# EasyEDA Pro project ESP32-S功能模块V2.epro

# Schematic ESP32-S功能模块V2_5V_GND互换
Board Name: ESP32-S功能模块V2_5V_GND互换; Create Date: 2025-08-16; Page Name: P1; Project Name: ESP32-S3功能模块; Schematic Name: ESP32-S功能模块V2_5V_GND互换; Update Date: 2025-08-16; Company: 嘉立创EDA; Page Size: A4; Version: V1.0
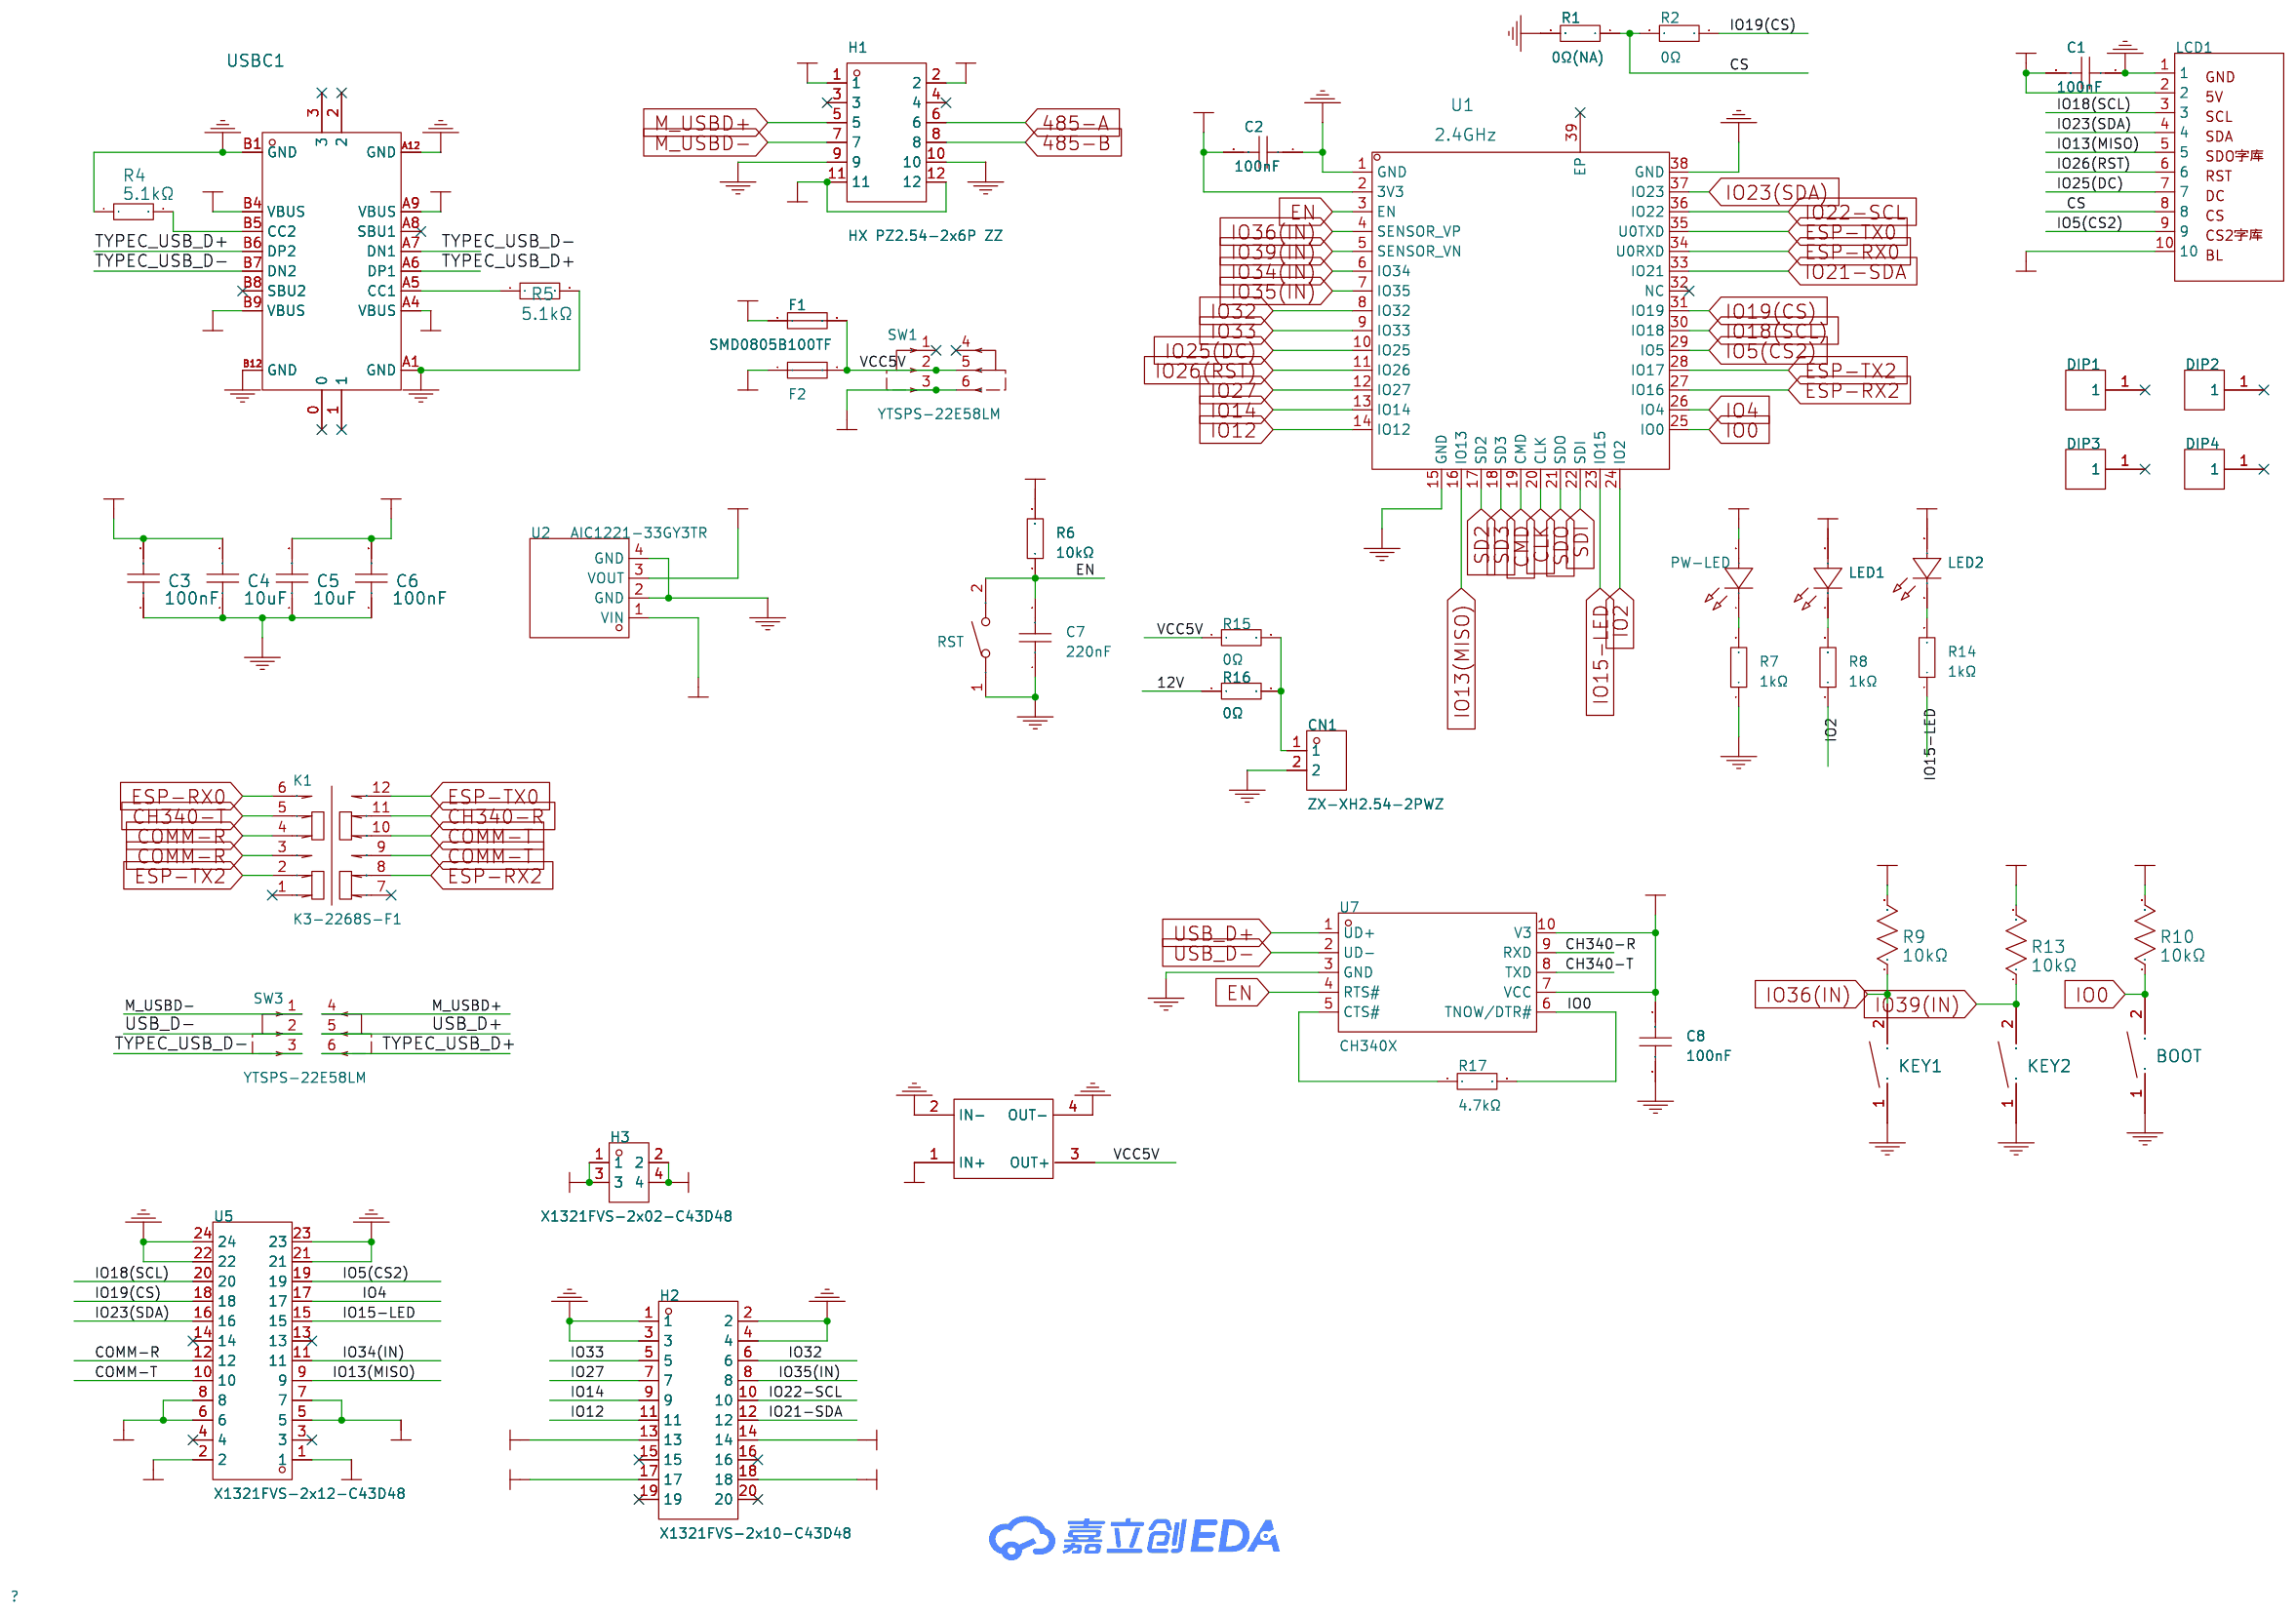
[diagram p0: schematic sheet]

## Parts
BOOT  TS-1088-AR02016  [SW-SMD_L3.9-W3.0-P4.45]
C1  100nF  [C0603]
C2  100nF  [C0603]
C3  100nF  [C0603]
C4  10uF  [C0805]
C5  10uF  [C0805]
C6  100nF  [C0603]
C7  220nF  [C0603]
C8  100nF  [C0603]
CN1  ZX-XH2.54-2PWZ  [CONN-TH_2P-P2.50_ZX-XH2.54-2PWZ]
DIP1  -  [贴片铜柱M3*6+1]
DIP2  -  [贴片铜柱M3*6+1]
DIP3  -  [贴片铜柱M3*6+1]
DIP4  -  [贴片铜柱M3*6+1]
F1  SMD0805B100TF  [F0805]
F2  SMD0805B100TF  [F0805]
H1  HX PZ2.54-2x6P ZZ  [HDR-TH_12P-P2.54-V-M-R2-C6-S2.54_77313-101-12LF]
H2  X1321FVS-2x10-C43D48  [HDR-SMD_20P-P1.27-V-F-R2-C10-LS4.8]
H3  X1321FVS-2x02-C43D48  [HDR-SMD_4P-P1.27-V-F-R2-C2-LS4.8]
K1  5.1kΩ  [SW-TH_K3-2268S-F1]
KEY1  TS665WS  [SW-SMD_L6.0-W6.0-LS6.6]
KEY2  TS665WS  [SW-SMD_L6.0-W6.0-LS6.6]
LCD1  -  [1.54寸带字库液晶屏]
LED1  XL-1608UBC-04  [LED0603-RD_BLUE]
LED2  XL-1608UBC-04  [LED0603-RD_BLUE]
PW-LED  XL-1608UBC-04  [LED0603-RD_BLUE]
R1  0Ω(NA)  [R0603]
R2  0Ω  [R0603]
R4  5.1kΩ  [R0603]
R5  5.1kΩ  [R0603]
R6  10kΩ  [R0603]
R7  1kΩ  [R0603]
R8  1kΩ  [R0603]
R9  10kΩ  [R0603]
R10  10kΩ  [R0603]
R13  10kΩ  [R0603]
R14  1kΩ  [R0603]
R15  0Ω  [R0603]
R16  0Ω  [R0603]
R17  4.7kΩ  [R0603]
RST  TS-1088-AR02016  [SW-SMD_L3.9-W3.0-P4.45]
SW1  YTSPS-22E58LM  [SW-SMD_6P-L5.8-W5.8-P2.00-LS8.0_YTSPS-22E58LM]
SW3  YTSPS-22E58LM  [SW-SMD_6P-L5.8-W5.8-P2.00-LS8.0_YTSPS-22E58LM]
U1  2.4GHz  [WIRELM-SMD_ESP32-S]
U2  AIC1221-33GY3TR  [SOT-223_L6.5-W3.5-P2.30-LS7.0-BR]
U5  X1321FVS-2x12-C43D48  [HDR-SMD_24P-P1.27-V-F-R2-C12-LS4.8]
U6  -  [DC-DCmini]
U7  CH340X  [MSOP-10_L3.0-W3.0-P0.50-LS5.0-BL]
USBC1  TYPE-C-31-M-12  [USB-C_SMD-TYPE-C-31-M-12]

## Library data of the parts
BOOT = TS-1088-AR02016: 电路结构:单刀单掷;按钮形状:圆形按钮;作用力:160gf;安装方式:立贴;开关长度:4mm;开关宽度:3mm;开关高度:2mm;带支架:不带;触点电流:50mA;额定电压(DC):12V;绝缘电阻:100MΩ;机械寿命:10万次;; LCSC Part Name: 4*3*2mm 立贴 轻触开关; Supplier Part: C720477; Manufacturer: XUNPU(讯普); Supplier Footprint: SMD; JLCPCB Part Class: Extended Part; Datasheet: https://atta.szlcsc.com/upload/public/pdf/source/20200810/C720475_60D09DD6C54279ADDB2DC25100F1CC11.pdf; Supplier: LCSC; Circuit: 单刀单掷; Actuator Style: 圆形按钮; Operating Force: 160gf; Mounting Style: 立贴; Switch Length: 4mm; Switch Width: 3mm; Switch Height: 2mm; Strike Gundam: 不带; Contact Current: 50mA; Voltage Rating (DC): 12V; Insulation Resistance: 100MΩ; Actuator/Cap Color: 黑色; Pin Style: SMD接片; Mechanical Life: 10万次; Operating Temperature: -30℃~+80℃
C1-C3 C6-C8 = CC0603KRX7R9BB104: 容值:100nF;精度:±10%;额定电压:50V;材质(温度系数):X7R;; LCSC Part Name: 100nF ±10% 50V; Supplier Part: C14663; Manufacturer: YAGEO(国巨); Supplier Footprint: 0603; JLCPCB Part Class: 基础库; Datasheet: https://atta.szlcsc.com/upload/public/pdf/source/20180910/C282072_33301C7F631E79921B82A8DAC6BCC5B3.pdf; Supplier: LCSC; Tolerance: ±10%; Voltage Rated: 50V; Temperature Coefficient: X7R
C4 C5 = CL21A106KAYNNNE_C15850: 容值:10uF;精度:±10%;额定电压:25V;材质(温度系数):X5R;; LCSC Part Name: 10uF ±10% 25V; Supplier Part: C15850; Manufacturer: SAMSUNG(三星); Manufacturer Part: CL21A106KAYNNNE; Supplier Footprint: 0805; JLCPCB Part Class: Basic Part; Datasheet: https://atta.szlcsc.com/upload/public/pdf/source/20160103/1457707679302.pdf; Supplier: LCSC; Tolerance: ±10%; Voltage Rated: 25V; Temperature Coefficient: X5R
CN1 = ZX-XH2.54-2PWZ: 插针结构:1x2P;间距:2.5mm;安装方式:弯插;参考系列:XH;总PIN数:2P;排数:1;每排PIN数:2;行距:-;额定电流:3A;触头材质:黄铜;触头镀层:锡;工作温度范围:-25℃~+85℃;; LCSC Part Name: 1x2P 间距:2.5mm 弯插 系列:XH; Supplier Part: C7429641; Manufacturer: Megastar(兆星); Supplier Footprint: 弯插,P=2.5mm; JLCPCB Part Class: 扩展库; Datasheet: https://atta.szlcsc.com/upload/public/pdf/source/20230619/56AE8F2E01CDFEAA97FC89B5ED558AB5.pdf; Supplier: LCSC; Pins Structure: 1x2P; Pitch: 2.5mm; Mounting Type: 弯插; Reference Series: XH; Number of Pins: 2P; Number of Rows: 1; Number of PINs Per Row: 2; Rated Current: 3A; Contact Material: 黄铜; Contact Plating: 锡; Operating Temperature: -25℃~+85℃; Rated Voltage (Max): 250V; Plastic Material: PA66; Flame Retardant Rating: UL94V-0; Color: 白色; Z-Height of the Board: 5.9mm; X-Length of Bottom Edge on Board (Spacing Line): 7.5mm; Y-Width of Bottom Edge on Board: 7.32mm
DIP1-DIP4 = 贴片铜柱M3*6+1
F1 F2 = SMD0805B050TF: 最大电压:6V;最大电流:100A;保持电流:500mA;跳闸电流:1A;最大动作时间:100ms;; LCSC Part Name: 6V 0.5A; Supplier Part: C269104; Manufacturer: Brightking(台湾君耀); Supplier Footprint: 0805; JLCPCB Part Class: Extended Part; Datasheet: https://atta.szlcsc.com/upload/public/pdf/source/20180814/C269104_466839A5DB65F6E723CA6A162ACE747B.pdf; Supplier: LCSC; Operating Voltage (Max): 6V; Current Rating (Max): 100A; Hold Current: 500mA; Trip Current: 1A; Maximum Time to Trip: 100ms
H1 = HX PZ2.54-2x6P ZZ: 插针结构:2x6P;间距:2.54mm;行距:2.54mm;圆针/方针:方针;安装类型:直插;排数:双排;总PIN位数:12P;额定电流:3A;额定电压:-;配合针长度:6mm;塑高:2.5mm;端接针长度:3mm;触头材质:黄铜;触头镀层:金;工作温度范围:-40℃~+105℃;颜色:黑色;; LCSC Part Name: 2x6P 间距:2.54mm 方针 直插; Supplier Part: C32713279; Manufacturer: hanxia(韩下); Supplier Footprint: 插件,P=2.54mm; JLCPCB Part Class: Extended Part; Datasheet: https://atta.szlcsc.com/upload/public/pdf/source/20240723/7CFD6BBE81D942E4FB6053E60626E655.pdf; Supplier: LCSC; Pin Structure: 2x6P; Pitch: 2.54mm; Row Spacing: 2.54mm; Circluar Pins/Square Pins: 方针; Mounting Type: 直插; Number of Rows: 双排; Number of Pins: 12P; Current Rating (Max): 3A; Length of Mating Pin: 6mm; Insulation Height: 2.5mm; Length of End Connection Pin: 3mm; Contact Material: 黄铜; Contact Plating: 金; Operating Temperature Range: -40℃~+105℃; Color: 黑色
H2 = X1321FVS-2x10-C43D48: 插孔结构:2x10P;间距:1.27mm;行距:-;圆孔/方孔:方孔;安装类型:立贴;排数:双排;总孔位数:20P;额定电流:1A;额定电压:250V;插孔方向:顶部;塑高:4.3mm;触头材质:黄铜;触头镀层:金;工作温度范围:-40℃~+105℃;焊接温度(最大值):260℃;; LCSC Part Name: 间距:1.27mm 2x10P 立贴; Supplier Part: C2684738; Manufacturer: XKB Connectivity(中国星坤); Supplier Footprint: SMD,P=1.27mm; JLCPCB Part Class: 扩展库; Datasheet: https://atta.szlcsc.com/upload/public/pdf/source/20211011/FC3020149D6BF5F353A6158A05565A46.pdf; Supplier: LCSC; Holes Structure: 2x10P; Pitch: 1.27mm; Circular Hole / Square Hole: 方孔; Mounting Type: 立贴; Number of Rows: 双排; Number of Holes: 20P; Current Rating (Max): 1A; Voltage Rating (Max): 250V; Holes Direction: 顶部; Insulation Height: 4.3mm; Contact Material: 黄铜; Contact Plating: 金; Operating Temperature Range: -40℃~+105℃; Soldering Temperature(Max): 260℃
H3 = X1321FVS-2x02-C43D48: 插孔结构:2x2P;间距:1.27mm;行距:-;圆孔/方孔:方孔;安装类型:立贴;排数:双排;总孔位数:4P;额定电流:1A;额定电压:250V;插孔方向:顶部;塑高:4.3mm;触头材质:黄铜;触头镀层:金;工作温度范围:-40℃~+105℃;焊接温度(最大值):260℃;; LCSC Part Name: 间距:1.27mm 2x2P 立贴; Supplier Part: C2684730; Manufacturer: XKB Connectivity(中国星坤); Supplier Footprint: SMD,P=1.27mm; JLCPCB Part Class: 扩展库; Datasheet: https://atta.szlcsc.com/upload/public/pdf/source/20211011/FC3020149D6BF5F353A6158A05565A46.pdf; Supplier: LCSC; Holes Structure: 2x2P; Pitch: 1.27mm; Circular Hole / Square Hole: 方孔; Mounting Type: 立贴; Number of Rows: 双排; Number of Holes: 4P; Current Rating (Max): 1A; Voltage Rating (Max): 250V; Holes Direction: 顶部; Insulation Height: 4.3mm; Contact Material: 黄铜; Contact Plating: 金; Operating Temperature Range: -40℃~+105℃; Soldering Temperature(Max): 260℃
K1 = K3-2268S-F1: 额定电流(DC):300mA;额定电压(DC):6V;额定电流(AC):-;额定电压(AC):-;电路结构:四刀双掷;安装方式:卧贴;机械寿命:1万次;开关颜色:黑色;; LCSC Part Name: 卧贴双档 滑动开关; Supplier Part: C223866; Manufacturer: 韩国韩荣; Supplier Footprint: SMD; JLCPCB Part Class: Extended Part; Datasheet: https://atta.szlcsc.com/upload/public/pdf/source/20210810/F3B8165E5EF761676C00BB7ABA008864.pdf; Supplier: LCSC; Current Rating (DC): 300mA; Voltage Rating (DC): 6V; Circuit: 四刀双掷; Mounting Style: 卧贴; Mechanical Life: 1万次; Actuator Color: 黑色; Actuator Style: 矩形柱状; Pin Style: 鸥翼型; Operating Temperature: -25℃~+80℃; Switch Length: 14.9mm; Switch Width: 3.5mm; Switch Height: 3.5mm; Tolerance: ±1%; Power(Watts): 100mW; Overload Voltage (Max): 75V; Temperature Coefficient: ±100ppm/℃; Type: 厚膜电阻; Operating Temperature Range: -55℃~+155℃
KEY1 KEY2 = TS665WS_C398058: 触点电流:50mA;额定电压(DC):12V;电路结构:单刀单掷;安装方式:立贴;带灯:-;作用力:200gf@±50gf;机械寿命:-;; LCSC Part Name: 6*6*5mm 立贴 轻触开关 无声软胶; Supplier Part: C398058; Manufacturer: SHOU HAN(首韩); Supplier Footprint: SMD; JLCPCB Part Class: Extended Part; Datasheet: https://atta.szlcsc.com/upload/public/pdf/source/20190620/C398058_75EC11C2CCBC6DD113AE79D58CB25A40.pdf; Supplier: LCSC; Contact Current: 50mA; Voltage Rating (DC): 12V; Circuit: 单刀单掷; Mounting Style: 立贴; Actuator Style: 圆形按钮; Operating Force: 200gf@±50gf; Switch Length: 6mm; Switch Width: 6mm; Switch Height: 5mm; Insulation Resistance: 100MΩ; Actuator/Cap Color: 黑色; Operating Temperature: -25℃~+70℃; Pin Style: SMD接片; Strike Gundam: 否
LCD1 = 1.54寸带字库液晶屏
LED1 LED2 PW-LED = XL-1608UBC-04: 灯头类型:-;发光颜色:蓝色;正向压降(Vf):3.3V;功率:70mW;正向电流:20mA;波长:455nm~475nm;二极管配置:-;透镜颜色:无色透明透镜;色温:-;发光强度:300mcd;发光角度:120°;载带方式:正贴;工作温度:-20℃~+85℃;; Supplier Part: C965807; Manufacturer: XINGLIGHT(成兴光); Supplier Footprint: 0603; JLCPCB Part Class: 扩展库; Datasheet: https://atta.szlcsc.com/upload/public/pdf/source/20250213/9D28F40E58C3285D8CA3C7212E2FBA3B.pdf; Supplier: LCSC; Illumination Color: 蓝色; Voltage - Forward(Vf): 3.3V; Power(Watts): 70mW; Forward Current: 20mA; Wavelength - Dominant: 455nm~475nm; Peak Wavelength: 470nm; Lens Color: 无色透明透镜; Luminous Intensity: 300mcd; Viewing Angle: 120°; Mounting Sytle: 正贴; Operating Temperature: -20℃~+85℃
R1 R2 R15 R16 = 0603WAF0000T5E: 电阻类型:厚膜电阻;阻值:0Ω;精度:±1%;功率:100mW;最大工作电压:75V;; LCSC Part Name: 0Ω ±1% 100mW 厚膜电阻; Supplier Part: C21189; Manufacturer: UNI-ROYAL(厚声); Supplier Footprint: 0603; JLCPCB Part Class: 基础库; Datasheet: https://atta.szlcsc.com/upload/public/pdf/source/20200306/C422600_1E6D84923E4A46A82E41ADD87F860B5C.pdf; Supplier: LCSC; Type: 厚膜电阻; Tolerance: ±1%; Power(Watts): 100mW; Overload Voltage (Max): 75V; Operating Temperature Range: -55℃~+155℃
R4 R5 = 0603WAF5101T5E: 阻值:5.1kΩ;精度:±1%;功率:100mW;温度系数:±100ppm/℃;电阻类型:厚膜电阻;; LCSC Part Name: 5.1kΩ ±1% 100mW 厚膜电阻; Supplier Part: C23186; Manufacturer: UNI-ROYAL(厚声); Supplier Footprint: 0603; JLCPCB Part Class: Basic Part; Datasheet: https://atta.szlcsc.com/upload/public/pdf/source/20200306/C422600_1E6D84923E4A46A82E41ADD87F860B5C.pdf; Supplier: LCSC; Tolerance: ±1%; Power(Watts): 100mW; Overload Voltage (Max): 75V; Temperature Coefficient: ±100ppm/℃; Type: 厚膜电阻; Operating Temperature Range: -55℃~+155℃
R6 R9 R10 R13 = 0603WAF1002T5E: 电阻类型:厚膜电阻;阻值:10kΩ;精度:±1%;功率:100mW;最大工作电压:75V;温度系数:±100ppm/℃;; LCSC Part Name: 厚膜电阻 10kΩ ±1% 100mW; Supplier Part: C25804; Manufacturer: UNI-ROYAL(厚声); Supplier Footprint: 0603; JLCPCB Part Class: 基础库; Datasheet: https://atta.szlcsc.com/upload/public/pdf/source/20200306/C422600_1E6D84923E4A46A82E41ADD87F860B5C.pdf; Supplier: LCSC; Type: 厚膜电阻; Tolerance: ±1%; Power(Watts): 100mW; Overload Voltage (Max): 75V; Temperature Coefficient: ±100ppm/℃; Operating Temperature Range: -55℃~+155℃
R7 R8 R14 = 0603WAF1001T5E: 电阻类型:厚膜电阻;阻值:1kΩ;精度:±1%;功率:100mW;最大工作电压:75V;温度系数:±100ppm/℃;; LCSC Part Name: 1kΩ ±1% 100mW 厚膜电阻; Supplier Part: C21190; Manufacturer: UNI-ROYAL(厚声); Supplier Footprint: 0603; JLCPCB Part Class: 基础库; Datasheet: https://atta.szlcsc.com/upload/public/pdf/source/20200306/C422600_1E6D84923E4A46A82E41ADD87F860B5C.pdf; Supplier: LCSC; Type: 厚膜电阻; Tolerance: ±1%; Power(Watts): 100mW; Overload Voltage (Max): 75V; Temperature Coefficient: ±100ppm/℃; Operating Temperature Range: -55℃~+155℃
R17 = 0603WAF4701T5E: 电阻类型:厚膜电阻;阻值:4.7kΩ;精度:±1%;功率:100mW;最大工作电压:75V;温度系数:±100ppm/℃;; LCSC Part Name: 4.7kΩ ±1% 100mW 厚膜电阻; Supplier Part: C23162; Manufacturer: UNI-ROYAL(厚声); Supplier Footprint: 0603; JLCPCB Part Class: 基础库; Datasheet: https://atta.szlcsc.com/upload/public/pdf/source/20200306/C422600_1E6D84923E4A46A82E41ADD87F860B5C.pdf; Supplier: LCSC; Type: 厚膜电阻; Tolerance: ±1%; Power(Watts): 100mW; Overload Voltage (Max): 75V; Temperature Coefficient: ±100ppm/℃; Operating Temperature Range: -55℃~+155℃
RST = TS-1088-AR02016: 电路结构:单刀单掷;按钮形状:圆形按钮;作用力:160gf;安装方式:立贴;开关长度:4mm;开关宽度:3mm;开关高度:2mm;带支架:不带;触点电流:50mA;额定电压(DC):12V;绝缘电阻:100MΩ;机械寿命:10万次;; LCSC Part Name: 4*3*2mm 立贴 轻触开关; Supplier Part: C720477; Manufacturer: XUNPU(讯普); Supplier Footprint: SMD; JLCPCB Part Class: 扩展库; Datasheet: https://atta.szlcsc.com/upload/public/pdf/source/20200810/C720475_60D09DD6C54279ADDB2DC25100F1CC11.pdf; Supplier: LCSC; Circuit: 单刀单掷; Actuator Style: 圆形按钮; Operating Force: 160gf; Mounting Style: 立贴; Switch Length: 4mm; Switch Width: 3mm; Switch Height: 2mm; Strike Gundam: 不带; Contact Current: 50mA; Voltage Rating (DC): 12V; Insulation Resistance: 100MΩ; Actuator/Cap Color: 黑色; Pin Style: SMD接片; Mechanical Life: 10万次; Operating Temperature: -30℃~+80℃
SW1 SW3 = YTSPS-22E58LM: 电路结构:双刀双掷;自锁/无锁:自锁;安装方式:立贴;触点电流:500mA;额定电压 (DC):50V;作用力:1.8N;机械寿命:2万次;; LCSC Part Name: 5.8x5.8mm 贴片按键开关; Supplier Part: C2941005; Manufacturer: YIYUAN(怡远); Supplier Footprint: SMD; JLCPCB Part Class: 扩展库; Datasheet: https://atta.szlcsc.com/upload/public/pdf/source/20220105/5C885D3D6FAB3BC8492E6C715FEB9C6C.pdf; Supplier: LCSC; Circuit: 双刀双掷; Self Lock / No Lock: 自锁; Actuator Style: 方形柱塞; Mounting Style: 立贴; Contact Current: 500mA; Voltage Rating (DC): 50V; Insulation Resistance: 1000MΩ; Actuator/Cap Color: 白色; Pin Style: PC引脚; Operating Force: 1.8N; Operating Temperature: -40℃~+85℃; Mechanical Life: 2万次
U1 = ESP32-S: 频率:2.4GHz;发射功率:17dBm;核心处理器:LX6;天线形式:板载 PCB 天线/外接 IPEX;接收灵敏度:-90dBm;; Supplier Part: C277944; Manufacturer: Ai-Thinker(安信可); Supplier Footprint: SMD; JLCPCB Part Class: Extended Part; Datasheet: https://atta.szlcsc.com/upload/public/pdf/source/20211217/F4BEA33E732D6002D10DAED85BBCB52B.pdf; Supplier: LCSC; Output Power: 17dBm; Core Processor: LX6; Support Interface: I2C；UART；DAC；SPI；PWM；ADC; Antenna Type: 板载 PCB 天线/外接 IPEX; Wireless Standard: 802.11b/g/n; Operating Voltage: 3.3V; Sensitivity: -90dBm; Operating Temperature: -40℃~+85℃
U2 = AIC1221-33GY3TR: 输出类型:固定;输出极性:正;最大输入电压:6V;输出电压:3.3V;输出电流:2A;电源纹波抑制比(PSRR):70dB@(1kHz);; Supplier Part: C211622; Manufacturer: AIC(沛亨半导体); Supplier Footprint: SOT-223; JLCPCB Part Class: 扩展库; Datasheet: https://atta.szlcsc.com/upload/public/pdf/source/20180412/C211622_EA532406C6A2C276C2B2012B0B841276.pdf; Supplier: LCSC; Output Type: 固定; Output Polarity: 正; Number of Outputs: 1; Maximum Input Voltage: 6V; Output Voltage: 3.3V; Dropout Voltage: 700mV@(2A); Output Current: 2A; Power Supply Rejection Ratio (PSRR): 70dB@(1kHz)
U5 = X1321FVS-2x12-C43D48: 插孔结构:2x12P;间距:1.27mm;行距:-;圆孔/方孔:方孔;安装类型:立贴;排数:双排;总孔位数:24P;额定电流:1A;额定电压:250V;插孔方向:顶部;塑高:4.3mm;触头材质:黄铜;触头镀层:金;工作温度范围:-40℃~+105℃;焊接温度(最大值):260℃;; LCSC Part Name: 间距:1.27mm 2x12P 立贴; Supplier Part: C2881860; Manufacturer: XKB Connectivity(中国星坤); Supplier Footprint: SMD,P=1.27mm; JLCPCB Part Class: 扩展库; Datasheet: https://atta.szlcsc.com/upload/public/pdf/source/20211011/FC3020149D6BF5F353A6158A05565A46.pdf; Supplier: LCSC; Holes Structure: 2x12P; Pitch: 1.27mm; Circular Hole / Square Hole: 方孔; Mounting Type: 立贴; Number of Rows: 双排; Number of Holes: 24P; Current Rating (Max): 1A; Voltage Rating (Max): 250V; Holes Direction: 顶部; Insulation Height: 4.3mm; Contact Material: 黄铜; Contact Plating: 金; Operating Temperature Range: -40℃~+105℃; Soldering Temperature(Max): 260℃
U6 = DC-DC模块mini
U7 = CH340X: Supplier Part: C3035748; Manufacturer: WCH(南京沁恒); Supplier Footprint: MSOP-10; JLCPCB Part Class: 扩展库; Datasheet: https://atta.szlcsc.com/upload/public/pdf/source/20230530/6E401E9554E9F5311886CC8B3F89B62E.pdf; Supplier: LCSC
USBC1 = TYPE-C-31-M-12: 连接器类型:Type-C;标准:-;公母:母;安装方式:-;触点数量:16P;端口数量:1;额定电流 - 电源:5A;工作温度范围:-;; LCSC Part Name: Type-C 母; Supplier Part: C165948; Manufacturer: 韩国韩荣; Supplier Footprint: SMD; JLCPCB Part Class: 扩展库; Datasheet: https://atta.szlcsc.com/upload/public/pdf/source/20220525/466408E853115E789EDB0DDC29077C05.pdf; Supplier: LCSC; Connector Type: Type-C; Gender: 母; Number of Contacts: 16P; Number of Ports: 1; Current Rating - Power (Max): 5A

## Nets
3.3V: C2.2 C5.2 C6.2 C8.1 H2.13 H2.14 LCD1.10 LED1.2(A) LED2.2(A) PW-LED.2(A) R6.2 R9.2 R10.2 R13.2 U1.2(3V3) U2.3(VOUT) U5.5 U5.6 U5.7 U5.8 U7.7(VCC) U7.10(V3)
5V: C1.2 C3.2 C4.2 H2.17 H2.18 LCD1.2 SW1.3 SW1.6 U2.1(VIN) U5.1 U5.2
12V: H1.1 H1.2 H3.1 H3.2 H3.3 H3.4 R16.1 U6.1(IN+)
GND: BOOT.1 C1.1 C2.1 C3.1 C4.1 C5.1 C6.1 C7.1 C8.2 CN1.2 H1.9 H1.10 H2.1 H2.2 H2.3 H2.4 KEY1.1 KEY2.1 LCD1.1 R1.2 R4.1 R5.2 R7.1 RST.1 U1.1(GND) U1.15(GND) U1.38(GND) U2.2(GND) U2.4(GND) U5.21 U5.22 U5.23 U5.24 U6.2(IN-) U6.4(OUT-) U7.3(GND) USBC1.A1(GND) USBC1.A12(GND) USBC1.B1(GND) USBC1.B12(GND)
VBUS: F1.1 USBC1.A4(VBUS) USBC1.A9(VBUS) USBC1.B4(VBUS) USBC1.B9(VBUS)
VCC5V: F1.2 F2.2 R15.1 SW1.2 SW1.5 U6.3(OUT+)
485-A: H1.6
485-B: H1.8
CH340-R: K1.11 U7.9(RXD)
CH340-T: K1.5 U7.8(TXD)
CLK: U1.20(CLK)
CMD: U1.19(CMD)
COMM-R: K1.3 K1.4 U5.12
COMM-T: K1.9 K1.10 U5.10
CS: LCD1.8 R1.1 R2.2
EN: C7.2 R6.1 RST.2 U1.3(EN) U7.4(RTS#)
ESP-RX0: K1.6 U1.34(U0RXD)
ESP-RX2: K1.8 U1.27(IO16)
ESP-TX0: K1.12 U1.35(U0TXD)
ESP-TX2: K1.2 U1.28(IO17)
IO0: BOOT.2 R10.1 R17.2 U1.25(IO0) U7.6(TNOW/DTR#)
IO2: R8.1 U1.24(IO2)
IO4: U1.26(IO4) U5.17
IO5(CS2): LCD1.9 U1.29(IO5) U5.19
IO12: H2.11 U1.14(IO12)
IO13(MISO): LCD1.5 U1.16(IO13) U5.9
IO14: H2.9 U1.13(IO14)
IO15-LED: R14.1 U1.23(IO15) U5.15
IO18(SCL): LCD1.3 U1.30(IO18) U5.20
IO19(CS): R2.1 U1.31(IO19) U5.18
IO21-SDA: H2.12 U1.33(IO21)
IO22-SCL: H2.10 U1.36(IO22)
IO23(SDA): LCD1.4 U1.37(IO23) U5.16
IO25(DC): LCD1.7 U1.10(IO25)
IO26(RST): LCD1.6 U1.11(IO26)
IO27: H2.7 U1.12(IO27)
IO32: H2.6 U1.8(IO32)
IO33: H2.5 U1.9(IO33)
IO34(IN): U1.6(IO34) U5.11
IO35(IN): H2.8 U1.7(IO35)
IO36(IN): KEY1.2 R9.1 U1.4(SENSOR_VP)
IO39(IN): KEY2.2 R13.1 U1.5(SENSOR_VN)
M_USBD+: H1.5 SW3.4
M_USBD-: H1.7 SW3.1
M_VCC: F2.1 H1.11 H1.12
SD2: U1.17(SD2)
SD3: U1.18(SD3)
SDI: U1.22(SDI)
SDO: U1.21(SDO)
TYPEC_USB_D+: SW3.6 USBC1.A6(DP1) USBC1.B6(DP2)
TYPEC_USB_D-: SW3.3 USBC1.A7(DN1) USBC1.B7(DN2)
USB_D+: SW3.5 U7.1(UD+)
USB_D-: SW3.2 U7.2(UD-)
$1N6077: R5.1 USBC1.A5(CC1)
$1N6100: R4.2 USBC1.B5(CC2)
$1N6280: PW-LED.1(K) R7.2
$1N6289: LED1.1(K) R8.2
$1N17912: LED2.1(K) R14.2
$1N31687: CN1.1 R15.2 R16.2
$1N33760: R17.1 U7.5(CTS#)

Not connected (* = marked no-connect by the designer): DIP1 1*; DIP2 1*; DIP3 1*; DIP4 1*; H1 3* 4*; H2 15* 16* 19* 20*; K1 1* 7*; SW1 1* 4*; U1 32(NC)* 39(EP)*; U5 3* 4* 13* 14*; USBC1 0* 1* 2* 3* A8(SBU1)* B8(SBU2)*

# Board ESP32-S功能模块V2_5V_GND互换
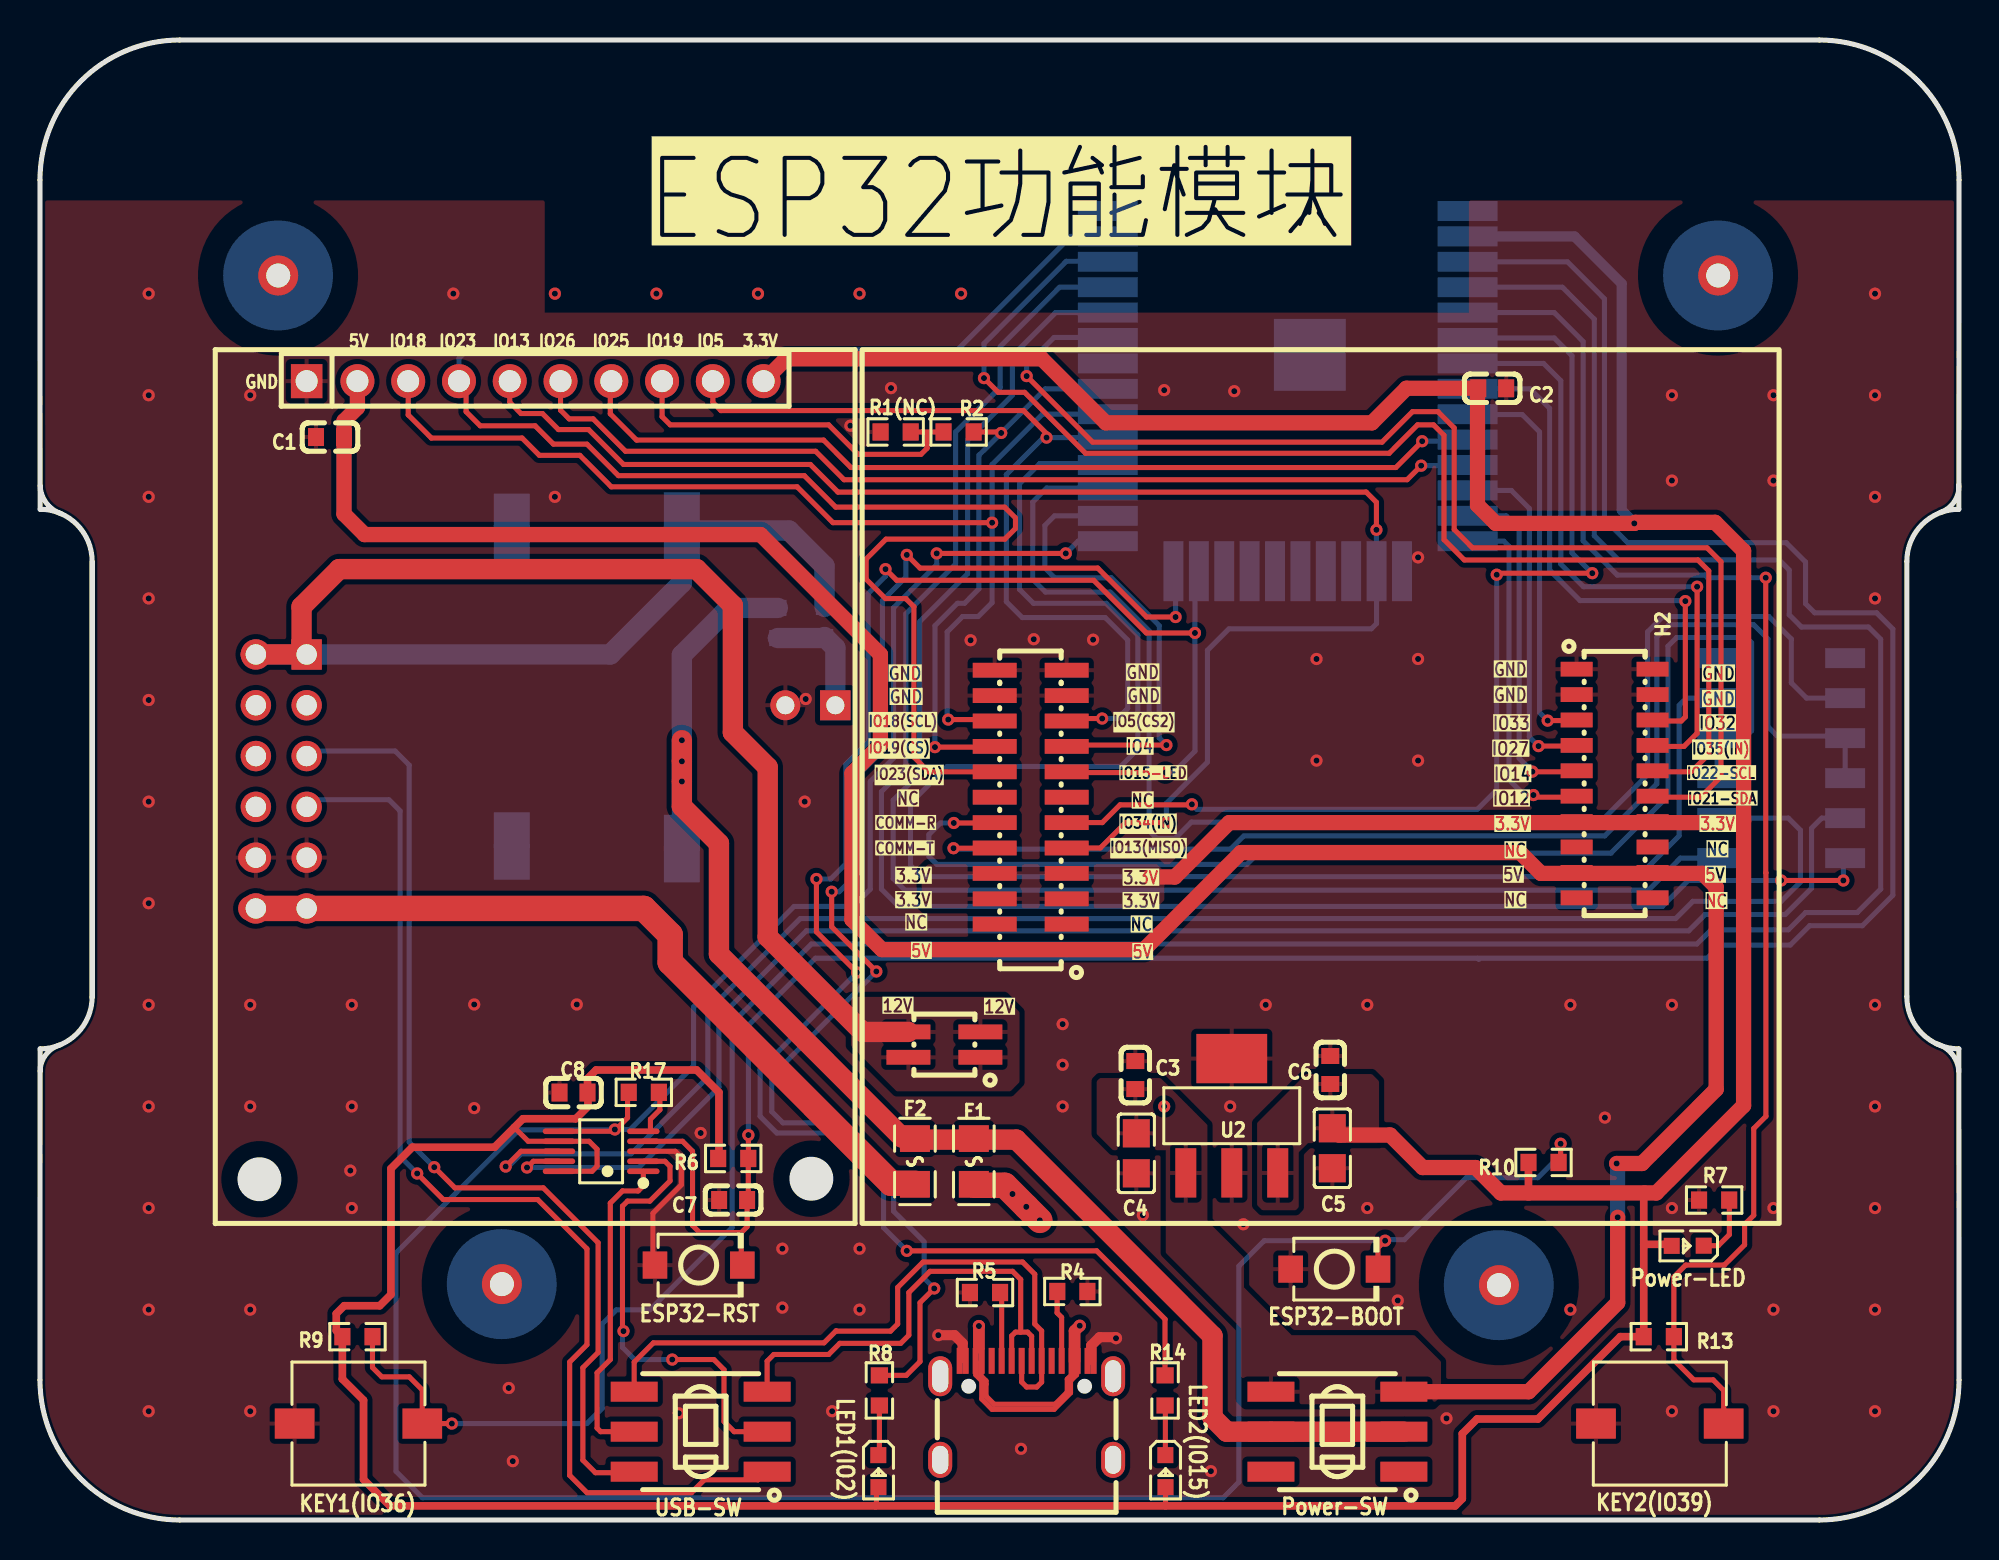
[diagram p1: board, top side]
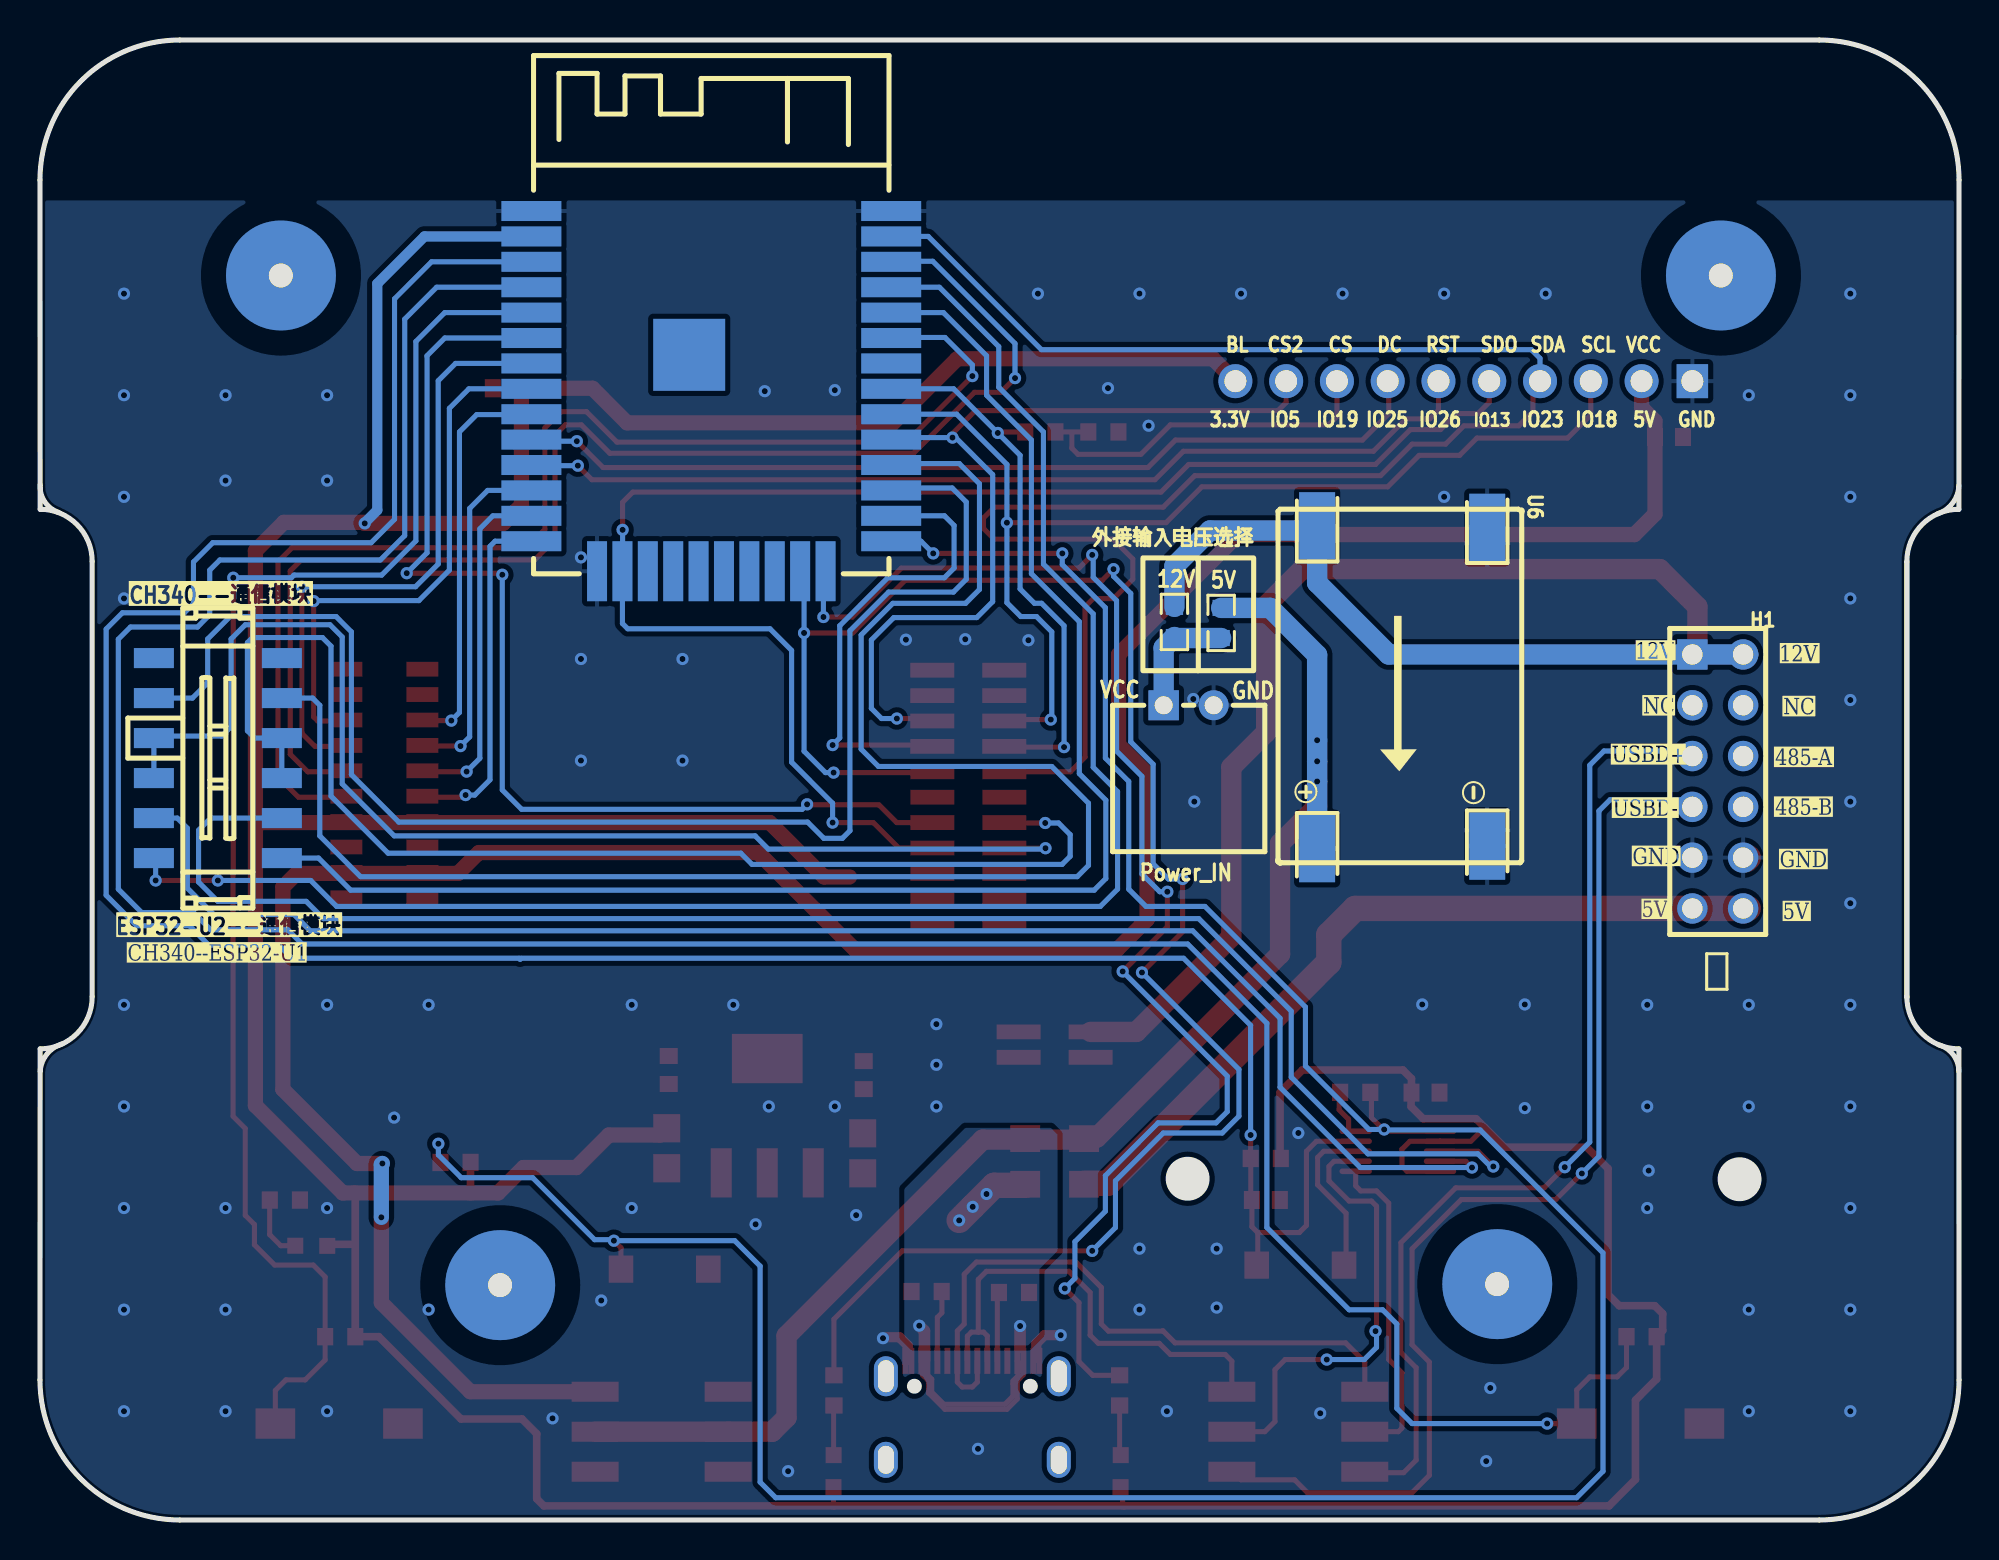
[diagram p2: board, bottom side, seen from below]

Outline 96 x 74 mm; copper layers: Top Layer, Bottom Layer. Coordinates in mm from the lower left corner of the outline.
Outline path: 0.01,22.44 arc(0.3,23.27) 1.03,23.76 ; 1.07,50.31 arc(0.32,50.85) 0.01,51.73 ; 2.61,47.89 2.61,26.11 ; 94.87,23.81 arc(95.65,23.3) 95.99,22.44 ; 95.99,51.76 arc(95.76,50.92) 95.07,50.38 ; 0,67 0.01,50.54 arc(1.85,49.77) 2.61,47.94 2.61,26.16 arc(1.85,24.32) 0.01,23.56 0,7 arc(2.05,2.05) 7,0 89,0 arc(93.95,2.05) 96,7 95.99,23.56 arc(94.15,24.32) 93.39,26.16 93.39,47.94 arc(94.15,49.77) 95.99,50.54 96,67 arc(93.95,71.95) 89,74 7,74 arc(2.05,71.95) 0,67
Stack: Top Layer 0.035mm / Dielectric1 1.51mm FR4 er 4.5 / Bottom Layer 0.035mm

## Design rules (mm)
template: JLCPCB Capability(Two Layers Board)
spacing copperThickness1oz (default): track to track 0.102, other pairs 0.152 to 0.3
spacing copperThickness2oz: track to track 0.203, other pairs 0.152 to 0.3
track width copperThickness1oz (default): min 0.127, default 0.254, max 2.54
track width copperThickness2oz: min 0.203, default 0.254, max 2.54
differential pair differentialPair (default): width min 0.127, default 0.254, max 2.54; gap min 0.152, default 0.152
via viaSize (default): diameter min 0.5, default 0.61, max 10; hole min 0.3, default 0.305, max 6.3

## Placement (name value [footprint] x y rotation side)
BOOT  TS-1088-AR02016  [SW-SMD_L3.9-W3.0-P4.45]  64.75 12.54 0 top
C1  100nF  [C0603]  14.51 54.15 0 top
C2  100nF  [C0603]  72.65 56.59 180 top
C3  100nF  [C0603]  54.79 22.25 270 top
C4  10uF  [C0805]  54.84 18.33 90 top
C5  10uF  [C0805]  64.65 18.59 90 top
C6  100nF  [C0603]  64.55 22.5 270 top
C7  220nF  [C0603]  34.67 16 0 top
C8  100nF  [C0603]  26.69 21.37 180 top
CN1  ZX-XH2.54-2PWZ  [CONN-TH_2P-P2.50_ZX-XH2.54-2PWZ]  38.54 40.74 180 bottom
DIP1  -  [贴片铜柱M3*6+1]  11.92 61.97 180 bottom
DIP2  -  [贴片铜柱M3*6+1]  83.95 61.97 180 bottom
DIP3  -  [贴片铜柱M3*6+1]  23.11 11.54 180 bottom
DIP4  -  [贴片铜柱M3*6+1]  72.98 11.49 180 bottom
F1  SMD0805B100TF  [F0805]  46.72 17.93 90 top
F2  SMD0805B100TF  [F0805]  43.77 17.93 90 top
H1  HX PZ2.54-2x6P ZZ  [HDR-TH_12P-P2.54-V-M-R2-C6-S2.54_77313-101-12LF]  12.07 36.93 270 bottom
H2  X1321FVS-2x10-C43D48  [HDR-SMD_20P-P1.27-V-F-R2-C10-LS4.8]  78.77 36.83 270 top
H3  X1321FVS-2x02-C43D48  [HDR-SMD_4P-P1.27-V-F-R2-C2-LS4.8]  45.24 23.77 90 top
K1  5.1kΩ  [SW-TH_K3-2268S-F1]  87.1 38.1 180 bottom
KEY1  TS665WS  [SW-SMD_L6.0-W6.0-LS6.6]  15.93 4.82 0 top
KEY2  TS665WS  [SW-SMD_L6.0-W6.0-LS6.6]  81.03 4.82 0 top
LCD1  -  [1.54寸带字库液晶屏]  24.77 45.56 0 top
LED1  XL-1608UBC-04  [LED0603-RD_BLUE]  41.94 2.44 270 top
LED2  XL-1608UBC-04  [LED0603-RD_BLUE]  56.3 2.44 270 top
PW-LED  XL-1608UBC-04  [LED0603-RD_BLUE]  82.43 13.71 180 top
R1(NC)  0Ω(NA)  [R0603]  42.8 54.4 180 top
R2  0Ω  [R0603]  45.95 54.4 180 top
R4  5.1kΩ  [R0603]  51.64 11.43 180 top
R5  5.1kΩ  [R0603]  47.27 11.37 180 top
R6  10kΩ  [R0603]  34.68 18.08 180 top
R7  1kΩ  [R0603]  83.75 16 0 top
R8  1kΩ  [R0603]  41.99 6.48 270 top
R9  10kΩ  [R0603]  15.88 9.17 180 top
R10  10kΩ  [R0603]  75.21 17.88 180 top
R13  10kΩ  [R0603]  80.98 9.17 180 top
R14  1kΩ  [R0603]  56.28 6.48 270 top
R15  0Ω  [R0603]  36.91 44.85 270 bottom
R16  0Ω  [R0603]  39.25 44.9 270 bottom
R17  4.7kΩ  [R0603]  30.21 21.38 180 top
RST  TS-1088-AR02016  [SW-SMD_L3.9-W3.0-P4.45]  32.95 12.75 0 top
SW1  YTSPS-22E58LM  [SW-SMD_6P-L5.8-W5.8-P2.00-LS8.0_YTSPS-22E58LM]  64.9 4.42 180 top
SW3  YTSPS-22E58LM  [SW-SMD_6P-L5.8-W5.8-P2.00-LS8.0_YTSPS-22E58LM]  33.05 4.42 180 top
U1  2.4GHz  [WIRELM-SMD_ESP32-S]  62.42 56.44 180 bottom
U2  AIC1221-33GY3TR  [SOT-223_L6.5-W3.5-P2.30-LS7.0-BR]  59.62 20.21 270 top
U5  X1321FVS-2x12-C43D48  [HDR-SMD_24P-P1.27-V-F-R2-C12-LS4.8]  49.56 35.5 90 top
U6  -  [DC-DCmini]  27.67 41.19 270 bottom
U7  CH340X  [MSOP-10_L3.0-W3.0-P0.50-LS5.0-BL]  28.07 18.44 90 top
USBC1  TYPE-C-31-M-12  [USB-C_SMD-TYPE-C-31-M-12]  49.36 5.48 0 top

## Footprints (pads in the part's own frame, mm; a bottom-side part is the same pattern mirrored in y, then rotated)
1.54寸带字库液晶屏
  rect 1.575x1.7 hole 1.1: 1(-11.43,11.379)
  round 1.7 hole 1.1: 2(-8.89,11.379) 3(-6.35,11.379) 4(-3.81,11.379) 5(-1.27,11.379) 6(1.27,11.379) 7(3.81,11.379) 8(6.35,11.379) 9(8.89,11.379) 10(11.43,11.379)
C0603
  rect 0.8x0.9 smd: 1(-0.7,0) 2(0.7,0)
C0805
  rect 1.41x1.35 smd: 1(-1,0) 2(1,0)
CONN-TH_2P-P2.50_ZX-XH2.54-2PWZ
  rect 1.524x1.5 hole 0.9: 1(-1.25,0)
  round 1.5 hole 0.9: 2(1.25,0)
DC-DCmini
  rect 1.8x1.8 smd: 1(-9.296,-4.445) 1(-7.721,-4.445) 2(-9.22,4.064) 2(-7.646,4.064) 3(6.832,-4.445) 3(8.408,-4.445) 4(6.705,4.064) 4(8.28,4.064)
F0805
  rect 1.335x1.5 smd: 1(-1.143,0) 2(1.143,0)
HDR-SMD_4P-P1.27-V-F-R2-C2-LS4.8
  rect 0.74x2.2 smd: 1(-0.635,-1.8) 2(-0.635,1.8) 3(0.635,-1.8) 4(0.635,1.8)
HDR-SMD_20P-P1.27-V-F-R2-C10-LS4.8
  rect 0.74x1.6 smd: 1(-5.715,-1.9) 2(-5.715,1.9) 3(-4.445,-1.9) 4(-4.445,1.9) 5(-3.175,-1.9) 6(-3.175,1.9) 7(-1.905,-1.9) 8(-1.905,1.9) 9(-0.635,-1.9) 10(-0.635,1.9) 11(0.635,-1.9) 12(0.635,1.9) 13(1.905,-1.9) 14(1.905,1.9) 15(3.175,-1.9) 16(3.175,1.9) 17(4.445,-1.9) 18(4.445,1.9) 19(5.715,-1.9) 20(5.715,1.9)
HDR-SMD_24P-P1.27-V-F-R2-C12-LS4.8
  rect 0.74x2.2 smd: 1(-6.985,-1.8) 2(-6.985,1.8) 3(-5.715,-1.8) 4(-5.715,1.8) 5(-4.445,-1.8) 6(-4.445,1.8) 7(-3.175,-1.8) 8(-3.175,1.8) 9(-1.905,-1.8) 10(-1.905,1.8) 11(-0.635,-1.8) 12(-0.635,1.8) 13(0.635,-1.8) 14(0.635,1.8) 15(1.905,-1.8) 16(1.905,1.8) 17(3.175,-1.8) 18(3.175,1.8) 19(4.445,-1.8) 20(4.445,1.8) 21(5.715,-1.8) 22(5.715,1.8) 23(6.985,-1.8) 24(6.985,1.8)
HDR-TH_12P-P2.54-V-M-R2-C6-S2.54_77313-101-12LF
  rect 1.52x1.52 hole 1.02: 1(-6.35,-1.27)
  round 1.52 hole 1.02: 2(-6.35,1.27) 3(-3.81,-1.27) 4(-3.81,1.27) 5(-1.27,-1.27) 6(-1.27,1.27) 7(1.27,-1.27) 8(1.27,1.27) 9(3.81,-1.27) 10(3.81,1.27) 11(6.35,-1.27) 12(6.35,1.27)
LED0603-RD_BLUE
  rect 0.8x0.8 smd: 1(-0.799,-0.004) 2(0.799,0.004)
MSOP-10_L3.0-W3.0-P0.50-LS5.0-BL
  oval 0.28x1.62 smd: 1(-1,-2.11) 2(-0.5,-2.11) 3(0,-2.11) 4(0.5,-2.11) 5(1,-2.11) 6(1,2.11) 7(0.5,2.11) 8(0,2.11) 9(-0.5,2.11) 10(-1,2.11)
R0603
  rect 0.806x0.864 smd: 1(-0.753,0) 2(0.753,0)
SOT-223_L6.5-W3.5-P2.30-LS7.0-BR
  rect 2.465x1.05 smd: 1(2.857,-2.3) 2(2.857,0) 3(2.857,2.3)
  rect 2.465x3.54 smd: 4(-2.857,0)
SW-SMD_6P-L5.8-W5.8-P2.00-LS8.0_YTSPS-22E58LM
  rect 2.35x1 smd: 1(-3.325,2) 2(-3.325,0) 3(-3.325,-2) 4(3.325,2) 5(3.325,0) 6(3.325,-2)
SW-SMD_L3.9-W3.0-P4.45
  rect 1.23x1.36 smd: 1(-2.185,0) 2(2.185,0)
SW-SMD_L6.0-W6.0-LS6.6
  rect 1.985x1.512 smd: 1(-3.192,0) 2(3.192,0)
SW-TH_K3-2268S-F1
  rect 2x1 smd: 1(3.2,5) 2(3.2,3) 3(3.2,1) 4(3.2,-1) 5(3.2,-3) 6(3.2,-5) 7(-3.2,5) 8(-3.2,3) 9(-3.2,1) 10(-3.2,-1) 11(-3.2,-3) 12(-3.2,-5)
USB-C_SMD-TYPE-C-31-M-12
  oval 1.2x2 hole 0.8x1.6: 0(-4.325,1.706) 1(4.325,1.706)
  oval 1.2x1.8 hole 0.8x1.4: 2(4.325,-2.474) 3(-4.325,-2.474)
  rect 0.3x1.3 smd: A1(-3.35,2.474) A4(-2.55,2.474) A5(-1.25,2.474) A6(-0.25,2.474) A7(0.25,2.474) A8(1.25,2.474) A9(2.55,2.474) A12(3.35,2.474) B1(3.05,2.474) B4(2.25,2.474) B5(1.75,2.474) B6(0.75,2.474) B7(-0.75,2.474) B8(-1.75,2.474) B9(-2.25,2.474) B12(-3.05,2.474)
WIRELM-SMD_ESP32-S
  rect 3x1 smd: 1(-9,9.005) 2(-9,7.735) 3(-9,6.465) 4(-9,5.195) 5(-9,3.925) 6(-9,2.655) 7(-9,1.385) 8(-9,0.115) 9(-9,-1.155) 10(-9,-2.425) 11(-9,-3.695) 12(-9,-4.965) 13(-9,-6.235) 14(-9,-7.505) 25(9,-7.505) 26(9,-6.235) 27(9,-4.965) 28(9,-3.695) 29(9,-2.425) 30(9,-1.155) 31(9,0.115) 32(9,1.385) 33(9,2.655) 34(9,3.925) 35(9,5.195) 36(9,6.465) 37(9,7.735) 38(9,9.005)
  rect 1x3 smd: 15(-5.715,-9.005) 16(-4.445,-9.005) 17(-3.175,-9.005) 18(-1.905,-9.005) 19(-0.635,-9.005) 20(0.635,-9.005) 21(1.905,-9.005) 22(3.175,-9.005) 23(4.445,-9.005) 24(5.715,-9.005)
  rect 3.6x3.6 smd: 39(-1.105,1.815)
贴片铜柱M3*6+1
  round 5.5 smd: 1(0.007,0.254)
  round 2 hole 1.2x1: 2(0,0.254)

## Nets
As in the schematic, except:
GND: BOOT.1 C1.1 C2.1 C3.1 C4.1 C5.1 C6.1 C7.1 C8.2 CN1.2 H1.9 H1.10 H2.1 H2.2 H2.3 H2.4 KEY1.1 KEY2.1 LCD1.1 R1(NC).2 R4.1 R5.2 R7.1 RST.1 U1.1 U1.15 U1.38 U2.2 U2.4 U5.21 U5.22 U5.23 U5.24 U6.2 U6.4 U7.3 USBC1.A1 USBC1.A12 USBC1.B1 USBC1.B12
CS: LCD1.8 R1(NC).1 R2.2

Pads without a net: DIP1 1 2; DIP2 1 2; DIP3 1 2; DIP4 1 2; H1 3 4; H2 15 16 19 20; K1 1 7; SW1 1 4; U1 32 39; U5 3 4 13 14; USBC1 0 1 2 3 A8 B8

## Via types
v1: diameter 0.61, hole 0.305, Top Layer to Bottom Layer, 154 vias

## Routing (per net, layer and track width the routed paths; a pad name or vN(x,y) marks a point on that pad's centre or on a via; arc(x,y) is an arc through that point)
3.3V: length 292.5
  Top Layer w0.254: U7.10 27.62,17.44 27.87,17.69 27.87,18.54 27.47,18.94 U7.7 24.42,18.94 23.73,19.63 ; 41.84,1.64 41.84,0.76 41.79,0.71 ; LED2.2 56.3,0.71 56.3,0.71
  Top Layer w0.381: 80.23,13.78 R13.2 79.05,9.17 74.94,5.05 71.89,5.05 71.15,4.31 71.15,1.06 70.8,0.71 17.51,0.71 16.19,2.03 16.19,5.99 15.13,7.05 R9.2 14.82,9.47 14.82,10.32 15.22,10.71 17,10.71 17.56,11.27 17.56,17.57 18.62,18.64 22.74,18.64 24.16,20.06 26.8,20.06 27.41,20.67 27.41,21.35 C8.1 27.39,22.07 27.82,22.5 32.85,22.5 33.97,21.38 33.97,18.12 R6.2 ; 80.23,13.78 80.23,16.31 80.27,16.35 ; 80.23,13.78 81.55,13.78 PW-LED.2 ; 74.46,16.35 R10.2
  Top Layer w0.762: 85.22,34.95 85.14,34.87 59.49,34.87 56.77,32.15 55.5,32.15 ; 85.22,34.95 85.22,48.46 83.8,49.88 79.81,49.88 v1(79.75,49.83) 72.83,49.83 71.91,50.74 71.91,56.59 ; 85.22,34.95 85.22,20.72 80.85,16.35 73.08,16.35 71.81,17.62 69.17,17.62 67.54,19.25 64.99,19.25 C5.2 ; 36.2,56.94 37.32,58.06 50.12,58.06 53.32,54.86 66.63,54.86 68.36,56.59 71.91,56.59 ; 71.91,56.59 C2.2
  Bottom Layer w0.508: U1.2 76.77,64.18 79.13,61.82 79.13,50.49 79.74,49.88
5V: length 133.2
  Top Layer w0.762: 15.88,56.94 15.88,55.62 15.21,54.95 C1.2 15.21,50.3 16.24,49.27 36.05,49.27 42.04,43.28 42.04,38.76 40.62,37.33 40.62,30.02 42.12,28.52 U5.2 U5.1 55.23,28.52 60.08,33.37 74.05,33.37 75.09,32.33 83.17,32.33 83.85,31.64 83.85,21.53 80.14,17.83 v1(78.87,17.83) ; SW1.3 74.47,6.42 78.92,10.87 v1(78.92,15.13)
  Bottom Layer w0.762: v1(78.92,15.13) 78.92,17.78 v1(78.87,17.83)
12V: length 89.6
  Top Layer w1.016: 10.55,43.28 13.09,43.28 13.09,45.66 14.97,47.54 32.85,47.54 34.66,45.73 34.66,39.38 36.4,37.64 36.4,29.15 41.15,24.41 H3.4
  Bottom Layer w1.016: R16.1 39.25,47.7 37.47,49.47 32.67,49.47 32.11,48.92 32.11,46.86 28.53,43.28 10.55,43.28
GND: length 12.5
  Top Layer w0.254: U7.3 31.78,18.44 32.09,18.13 32.09,16.76 30.66,15.34 30.66,12.85 RST.1
  Top Layer w0.508: v1(44.94,9.24) 45.75,9.24 46.16,8.83 46.16,8.11 ; v1(53.83,9.09) 53.78,9.14 53,9.14 52.59,8.72 52.59,8.01
  Top Layer w1.27: 10.55,33.12 10.65,33.02
  vias: v1(5.44,61.32) v1(5.44,56.24) v1(5.44,51.16) v1(5.44,46.08) v1(5.44,41) v1(5.44,35.92) v1(5.44,30.84) v1(5.44,25.76) v1(5.44,20.68) v1(5.44,15.6) v1(5.44,10.52) v1(5.44,5.44) v1(10.52,56.24) v1(10.52,25.76) v1(10.52,20.68) v1(10.52,10.52) v1(10.52,5.44) v1(15.52,17.47) v1(15.6,25.76) v1(15.6,20.68) v1(15.6,15.6) v1(20.68,61.32) v1(21.72,25.78) v1(21.72,20.59) v1(23.45,6.6) v1(23.65,2.94) v1(25.76,61.32) v1(25.76,51.16) v1(26.85,25.78) v1(30.84,61.32) v1(31.96,5.34) v1(33.05,19.35) v1(35.92,61.32) v1(37.14,13.57) v1(37.14,10.62) v1(38.31,41.05) v1(38.26,35.92) v1(39.63,5.44) v1(40.54,54.71) v1(41,61.32) v1(41,13.57) v1(41,10.52) v1(42.57,56.59) v1(46.08,61.32) v1(46.55,43.99) v1(49.08,3.56) v1(49.71,44.04) v1(51.16,24.79) v1(51.16,22.76) v1(51.16,20.68) v1(52.68,44.02) v1(55.17,15.24) v1(56.24,56.49) v1(56.24,20.68) v1(58.58,2.44) v1(59.54,20.68) v1(59.74,56.44) v1(60.2,14.79) v1(61.32,25.76) v1(63.86,43.05) v1(63.86,37.97) v1(66.4,25.76) v1(66.4,15.6) v1(67.92,10.98) v1(68.94,48.13) v1(68.94,43.05) v1(68.94,37.97) v1(70.36,5.08) v1(76.56,25.76) v1(76.56,10.52) v1(78.29,20.12) v1(81.64,56.24) v1(81.64,51.97) v1(81.64,25.76) v1(81.64,15.6) v1(81.64,5.44) v1(86.72,56.24) v1(86.72,51.97) v1(86.72,15.6) v1(86.72,10.52) v1(86.72,5.44) v1(91.8,61.32) v1(91.8,56.24) v1(91.8,51.16) v1(91.8,46.08) v1(91.8,25.76) v1(91.8,20.68) v1(91.8,15.6) v1(91.8,10.52) v1(91.8,5.44)
VBUS: length 23.8
  Top Layer w0.254: 47.33,6.8 47.33,6.96 47.07,7.21 47.07,7.92 USBC1.B9 ; 47.33,6.8 47.22,6.9 ; 47.33,6.8 47.33,6.19 47.73,5.79 50.78,5.79 51.39,6.4 51.39,7.04 51.69,7.35 51.69,7.87 ; USBC1.A4 46.81,7.91 46.82,7.9 46.82,7.25 47.11,6.96 47.11,6.05 47.63,5.53 50.73,5.53 51.55,6.36 51.55,6.96 51.86,7.26 51.86,7.96
  Top Layer w0.584: v1(46.97,9.7) 46.97,8.63 ; 51.76,7.96 51.76,9.45 v1(52.02,9.71)
  Top Layer w1.27: v1(50.02,14.98) v1(49.34,15.66) 48.27,16.73 46.72,16.73
  vias: v1(48.65,16.3)
VCC5V: length 74.2
  Top Layer w1.016: SW1.2 SW1.5 59.37,4.41 58.65,5.13 58.65,9.2 48.84,19.02 43.87,19.02 43.77,19.12 43.14,19.12 33.97,28.29 33.97,33.83 32.11,35.68 v1(32.11,36.93) v1(32.11,37.93) v1(32.11,38.99)
  Bottom Layer w1.016: R15.1 34.46,45.61 32.11,43.25 v1(32.11,38.99) v1(32.11,37.93) v1(32.11,36.93) U6.3 U6.3
(no net): length 0.2
  Top Layer w0.254: 76.84,31.19 76.97,31.06
CH340-R: length 78.7
  Top Layer w0.254: v1(24.36,17.62) 24.68,17.94 U7.9
  Bottom Layer w0.254: 90.3,35.1 89.13,35.1 88.63,34.59 88.63,31.59 87.31,30.27 83.29,30.27 82.48,29.46 38.33,29.46 33.97,25.09 33.97,21.64 29.95,17.62 v1(24.36,17.62)
CH340-T: length 82.6
  Top Layer w0.254: U7.8 24.06,18.44 v1(23.3,17.67)
  Bottom Layer w0.254: v1(23.3,17.67) 23.44,17.67 24.07,18.31 29.57,18.31 33.41,22.14 33.41,25.45 38.03,30.07 81.82,30.07 82.68,30.93 87.1,30.93 88.07,31.9 88.07,34.49 87.46,35.1 K1.5
COMM-R: length 63.4
  Top Layer w0.254: v1(45.71,34.85) 47.74,34.85 U5.12
  Bottom Layer w0.254: K1.4 K1.3 85.26,39.1 85.62,39.46 85.62,43.87 85.37,44.12 81.87,44.12 81.44,43.69 81.44,36.2 78.58,33.34 60.94,33.34 60.38,32.78 44.87,32.78 44.47,33.18 44.47,34.27 45.05,34.85 v1(45.71,34.85)
COMM-T: length 62.6
  Top Layer w0.254: v1(45.7,33.59) 47.75,33.59 U5.10
  Bottom Layer w0.254: 90.3,37.1 90.3,39.1 90.2,39.2 86.91,39.2 86.44,39.66 86.44,44.05 85.73,44.76 81.49,44.76 80.88,44.15 80.88,36.81 78.28,34.21 60.23,34.21 59.56,33.54 45.74,33.54 v1(45.7,33.59)
CS: length 18.3
  Top Layer w0.254: 31.12,56.94 31.12,55.17 31.53,54.76 39.45,54.76 40.92,53.28 44.07,53.28 44.38,53.59 44.38,54.35 ; R2.2 R1(NC).1
EN: length 131
  Top Layer w0.254: RST.2 35.08,12.8 35.08,14.37 ; 35.08,14.37 33,14.37 32.64,14.73 32.64,18.44 32.14,18.94 U7.4 ; 35.08,14.37 35.37,14.66 C7.2 35.43,16.06 R6.1 35.44,18.08 v1(35.44,19.25)
  Bottom Layer w0.254: U1.3 76.41,62.91 78.26,61.06 78.26,50.03 79.43,48.86 87.36,48.86 88.32,47.9 88.32,45.82 88.78,45.36 91.88,45.36 92.69,44.55 92.69,31.24 91.17,29.71 88.52,29.71 87.56,28.75 84.05,28.75 83.39,28.09 72.03,28.09 71.98,28.04 71.93,28.09 38.79,28.09 35.44,24.73 v1(35.44,19.25)
ESP-RX0: length 76.4
  Bottom Layer w0.254: U1.34 50.8,60.37 48.65,58.21 48.65,56.24 46.4,54 46.4,47.32 44.01,44.92 44.01,37.32 42.68,35.99 42.68,32.07 43.26,31.49 80.46,31.49 82.06,33.1 K1.6
ESP-RX2: length 71.6
  Bottom Layer w0.254: U1.27 53.3,51.6 50.36,51.6 49.66,50.9 49.66,47.04 50.3,46.4 53.54,46.4 55.48,44.46 55.48,34.46 55.86,34.08 56.78,34.08 57.6,34.89 78.05,34.89 80.42,37.27 80.42,44.41 81.19,45.17 86.49,45.17 87.61,44.05 87.61,41.86 88.37,41.1 90.3,41.1
ESP-TX0: length 86.4
  Top Layer w0.254: v1(90.21,31.98) v1(87.1,31.98)
  Bottom Layer w0.254: 90.3,33.1 90.21,33.01 v1(90.21,31.98) ; U1.35 51.01,61.64 48.04,58.67 48.04,56.64 45.8,54.4 45.8,47.8 43.31,45.31 43.31,37.64 42.09,36.42 42.09,31.54 42.96,30.68 81.16,30.68 82.46,31.98 v1(87.1,31.98)
ESP-TX2: length 86.4
  Bottom Layer w0.254: K1.2 82.36,41.1 82,40.74 82,34.21 79.96,32.17 44.11,32.17 43.55,32.73 43.55,35.84 45.38,37.68 54.05,37.68 54.92,38.54 54.92,44.25 53.34,45.83 49.7,45.83 49,46.53 49,51.81 50.01,52.82 53.34,52.82 U1.28
IO0: length 151.1
  Top Layer w0.254: v1(51.32,48.33) v1(44.86,48.33) ; 76.12,17.83 76.07,17.88 v1(76.07,18.81) ; 29.5,21.18 29.39,21.07 29.39,20.11 28.81,19.53 v1(28.76,19.53) 28.67,19.44 U7.6 ; v1(67.29,13.97) 66.93,13.61 BOOT.2
  Bottom Layer w0.254: U1.25 51.93,48.94 v1(51.32,48.33) ; v1(76.07,18.81) 76.07,18.25 74.93,17.11 71.35,17.11 68.26,14.02 67.34,14.02 v1(67.29,13.97) 61.24,13.97 59.98,12.7 59.98,1.89 59.19,1.11 19.13,1.11 17.81,2.43 17.81,13.36 23.96,19.5 28.73,19.5 v1(28.76,19.53) 29.52,19.53 32.7,22.7 32.7,25.65 37.72,30.68 40.67,30.68 41.53,31.54 41.53,36.93 42.7,38.1 42.7,45.61 44.86,47.77 v1(44.86,48.33)
IO2: length 70
  Top Layer w0.254: v1(41.84,27.43) 39.6,29.66 v1(39.6,31.41) ; v1(44.73,11.58) 44.02,10.87 44.02,7.92 43.34,7.23 41.89,7.23 ; v1(56.81,45.15) 55.36,45.15 52.91,47.59 44.02,47.59 v1(43.36,48.26)
  Bottom Layer w0.254: v1(44.73,11.58) 44.23,12.09 44.23,13.91 42.7,15.44 42.7,17.22 40.06,19.86 37.17,19.86 36.61,20.42 36.61,22.19 v1(41.84,27.43) ; v1(56.81,45.15) 56.81,47.33 U1.24 ; v1(39.6,31.41) 39.98,31.41 40.87,32.3 40.87,37.18 42.14,38.45 42.14,45.97 43.31,47.14 43.31,48.2 v1(43.36,48.26)
IO4: length 23.5
  Top Layer w0.254: v1(56.35,38.75) 51.43,38.75 U5.17
  Bottom Layer w0.254: U1.26 50.75,50.21 50.27,49.73 50.27,47.59 50.76,47.11 53.59,47.11 55.99,44.71 55.99,39.1 v1(56.35,38.75)
IO5(CS2): length 44.4
  Top Layer w0.254: U5.19 51.48,40.07 v1(53.14,40.07) ; 33.66,56.94 33.66,55.88 34.07,55.47 49.21,55.47 50.35,54.32 v1(50.35,54.12)
  Bottom Layer w0.254: v1(53.14,40.07) 53.9,40.07 54.41,40.58 54.41,44 53.29,45.12 49.14,45.12 48.34,45.92 48.34,52.27 50.19,54.12 v1(50.35,54.12) 53.32,54.12 U1.29
IO12: length 17.7
  Top Layer w0.254: v1(74.71,36.25) 74.82,36.14 76.97,36.14
  Bottom Layer w0.254: U1.14 73.23,48.94 73.49,48.69 73.49,37.01 74.25,36.25 v1(74.71,36.25)
IO13(MISO): length 76.5
  Top Layer w0.254: v1(56.35,34.87) 54.31,34.87 53.04,33.6 U5.9 ; v1(66.86,49.51) 66.86,50.89 66.34,51.39 39.92,51.39 38.54,52.78 29.19,52.78 27.44,54.52 25.94,54.52 25.14,55.32 24.06,55.32 23.5,55.89 23.5,56.94
  Bottom Layer w0.254: v1(56.35,34.87) 56.35,35.84 58.4,37.89 58.4,43.48 59.48,44.56 66.6,44.56 66.86,44.83 U1.16 66.86,47.45 v1(66.86,49.51)
IO14: length 17.7
  Top Layer w0.254: 76.97,37.41 74.62,37.41 74.63,37.42 v1(74.66,37.42)
  Bottom Layer w0.254: U1.13 73.34,50.21 74,49.56 74,38.08 v1(74.66,37.42)
IO15-LED: length 93.4
  Top Layer w0.254: v1(43.36,13.46) 52.86,13.46 56.28,10.04 R14.1 ; v1(56.3,37.37) 51.4,37.37 U5.15 ; v1(38.84,32.05) 38.84,29.41 v1(40.87,27.38) ; v1(57.78,44.35) 55.34,44.35 52.71,46.99 42.86,46.99 v1(42.3,47.54)
  Bottom Layer w0.254: v1(56.3,37.37) 56.71,37.37 57.78,38.44 v1(57.78,44.35) 57.78,47.24 U1.23 ; v1(40.87,27.38) 36.02,22.53 36.02,20.19 36.86,19.35 39.81,19.35 42.2,16.96 42.2,14.62 v1(43.36,13.46) ; v1(42.3,47.54) 42.3,47.19 41.43,46.33 41.43,38.91 40.32,37.79 40.32,32.81 39.55,32.05 v1(38.84,32.05)
IO18(SCL): length 56.5
  Top Layer w0.254: 18.42,56.94 18.42,55.25 19.58,54.1 24.12,54.1 24.98,53.23 27.01,53.23 28.58,51.66 37.88,51.66 39.67,49.87 v1(47.63,49.87) ; U5.20 47.69,40.02 v1(45.43,40.02)
  Bottom Layer w0.254: U1.30 50.14,55.29 47.63,52.77 47.63,45.87 46.94,45.17 46.15,45.17 45.38,44.41 45.38,40.07 v1(45.43,40.02)
IO19(CS): length 27.9
  Top Layer w0.254: v1(44.77,38.64) 47.73,38.64 U5.18 ; R2.1 48.03,54.4 v1(48.08,54.35)
  Bottom Layer w0.254: v1(44.77,38.64) 44.77,44.71 45.89,45.84 46.25,45.84 46.97,46.55 46.97,53.24 v1(48.08,54.35) 50.29,56.56 U1.31
IO21-SDA: length 62.7
  Top Layer w0.254: 80.57,36.14 83.07,36.14 84.09,37.17 84.09,47.91 83.39,48.61 71.66,48.61 70.74,49.53 70.74,54.61 69.93,55.42 68.66,55.42 67.14,53.89 52.66,53.89 v1(49.36,57.2)
  Bottom Layer w0.254: U1.33 53.39,59.13 50.73,59.13 49.36,57.75 v1(49.36,57.2)
IO22-SCL: length 66.6
  Top Layer w0.254: v1(47.22,57.09) 47.94,56.38 49.26,56.38 52.3,53.34 67.49,53.34 68.92,54.76 69.71,54.76 70.24,54.23 70.24,49.02 71.25,48 82.94,48 83.48,47.46 83.48,38.29 82.6,37.41 80.57,37.41
  Bottom Layer w0.254: U1.36 53.39,62.94 51.34,62.94 47.22,58.82 v1(47.22,57.09)
IO23(SDA): length 91.9
  Top Layer w0.254: 20.96,56.94 21.32,56.59 21.32,55.42 22.02,54.71 24.77,54.71 25.69,53.79 27.36,53.79 28.94,52.22 38.23,52.22 39.81,50.64 48.26,50.64 48.8,50.1 48.8,49.58 48.27,49.04 42.32,49.04 41.33,48.05 41.33,47.04 42.3,46.07 43.31,46.07 43.72,45.66 43.72,38.15 44.46,37.41 U5.16
  Bottom Layer w0.254: U1.37 51.57,64.18 45.9,58.52 21.39,58.52 20.96,58.08 20.96,56.94
IO25(DC): length 46.2
  Top Layer w0.254: 28.58,56.94 28.53,56.89 28.53,55.31 29.84,54 39.2,54 40.57,52.62 67.83,52.62 v1(69.14,53.94)
  Bottom Layer w0.254: U1.10 71.34,53.94 v1(69.14,53.94)
IO26(RST): length 48.6
  Top Layer w0.254: 26.04,56.94 26.04,55.49 26.47,55.06 27.67,55.06 29.29,53.44 38.8,53.44 40.22,52.01 68.39,52.01 v1(69.09,52.72)
  Bottom Layer w0.254: v1(69.09,52.72) 71.39,52.72 U1.11
IO27: length 17.5
  Top Layer w0.254: 76.97,38.68 76.95,38.7 v1(74.96,38.7)
  Bottom Layer w0.254: v1(74.96,38.7) 74.51,39.15 74.51,50.58 73.61,51.48 U1.12
IO32: length 27.6
  Top Layer w0.254: 80.57,39.95 82.11,39.95 82.31,40.15 v1(82.31,45.95)
  Bottom Layer w0.254: v1(82.31,45.95) 82.29,45.97 77.04,45.97 75.52,47.49 75.52,55.58 74.54,56.56 U1.8
IO33: length 20.1
  Top Layer w0.254: 76.97,39.95 76.95,39.97 v1(75.42,39.97)
  Bottom Layer w0.254: v1(75.42,39.97) 75.02,40.38 75.02,54.41 74.15,55.27 71.44,55.27
IO34(IN): length 54.8
  Top Layer w0.254: v1(77.65,47.34) 72.95,47.34 v1(72.87,47.26) ; U5.11 53.14,34.87 54.03,35.76 57.6,35.76 v1(57.62,35.78)
  Bottom Layer w0.254: U1.6 75.75,59.1 76.64,58.21 76.64,48.36 v1(77.65,47.34) ; v1(72.87,47.26) 72.87,36.5 71.9,35.53 57.87,35.53 v1(57.62,35.78)
IO35(IN): length 31.4
  Top Layer w0.254: v1(82.9,46.66) 82.9,39.34 82.24,38.68 80.57,38.68
  Bottom Layer w0.254: U1.7 75.21,57.83 76.08,56.96 76.08,47.8 77.21,46.66 v1(82.9,46.66)
IO36(IN): length 146.7
  Top Layer w0.254: v1(20.61,4.82) KEY1.2 19.12,6.51 18.47,7.16 17.1,7.16 16.63,7.62 16.63,9.06
  Bottom Layer w0.254: v1(20.61,4.82) 27.36,4.82 28.12,5.58 28.12,9.8 28.83,10.51 30.51,10.51 34.63,14.63 34.63,24.84 38.59,28.8 82.89,28.8 83.6,29.51 87.46,29.51 88.32,30.37 90.91,30.37 92.08,31.54 92.08,44.04 91.47,44.65 88.12,44.65 87.51,45.26 87.51,47.49 87,48 78.97,48 77.76,49.22 77.76,60.04 76.16,61.64 U1.4
IO39(IN): length 73.1
  Top Layer w0.254: 81.74,9.06 81.74,8 82.73,7.01 83.7,7.01 84.23,6.48 KEY2.2 ; R13.1 81.74,12.15 82.33,12.75 84.26,12.75 85.27,13.76 85.27,14.78 85.73,15.24 85.73,19.57 86.34,20.18 86.34,32.36 86.33,32.37 v1(86.33,47.11)
  Bottom Layer w0.254: U1.5 75.75,60.37 77.2,58.92 77.2,48.96 78.9,47.25 83.29,47.25 83.43,47.11 v1(86.33,47.11)
M_USBD+: length 50.2
  Top Layer w0.254: SW3.4 29.67,2.37 27.79,2.37 27.16,2.99 27.16,7.62 27.92,8.38 27.92,13.86 25.18,16.61 20.76,16.61 v1(19.72,17.64)
  Bottom Layer w0.254: 13.09,38.2 13.34,38.45 17.76,38.45 18.47,37.74 18.47,18.89 v1(19.72,17.64)
M_USBD-: length 56.2
  Top Layer w0.254: v1(18.87,17.33) 20.17,16.02 24.9,16.02 27.36,13.56 27.36,8.76 26.5,7.9 26.5,2.23 27.36,1.37 32.59,1.37 33.24,2.01 35.92,2.01 36.33,2.42 SW3.1
  Bottom Layer w0.254: 13.09,35.66 13.44,36.01 17.46,36.01 18.01,35.45 18.01,18.18 v1(18.87,17.33)
M_VCC: length 39.7
  Top Layer w1.27: 10.55,30.58 30.21,30.58 31.53,29.26 31.53,27.88 42.58,16.84 43.77,16.84
TYPEC_USB_D+: length 32.7
  Top Layer w0.254: USBC1.A6 49.11,6.9 49.36,6.65 49.87,6.65 50.11,6.89 USBC1.B6 50.11,9.46 49.76,9.8 49.76,12.29 49.15,12.9 44.18,12.9 42.91,11.63 42.91,9.8 42.55,9.44 39.84,9.44 39.82,9.46 39.22,8.86 30.69,8.86 29.73,7.9 SW3.6
TYPEC_USB_D-: length 23.8
  Top Layer w0.254: 49.06,9.39 49.4,9.39 49.61,9.19 USBC1.A7 ; 49.06,9.39 48.8,9.39 48.61,9.2 USBC1.B7 ; 49.06,9.39 49.06,12.03 48.65,12.43 44.52,12.43 43.46,11.37 43.46,9.24 43.06,8.83 40.01,8.83 39.45,8.28 36.71,8.28 36.38,7.94 SW3.3
USB_D+: length 16.2
  Top Layer w0.254: SW3.5 28.05,4.42 27.87,4.59 27.87,7.36 28.53,8.02 28.53,15.84 29.14,16.45 29.93,16.45 30.18,16.71 U7.1
USB_D-: length 22.7
  Top Layer w0.254: v1(29.19,9.44) 29.14,9.5 29.14,15.69 29.39,15.95 30.51,15.95 31.52,16.95 31.52,17.68 31.27,17.94 U7.2 ; v1(31.63,8.02) 33.71,8.02 34.22,7.51 34.22,4.92 34.73,4.42 SW3.2
  Bottom Layer w0.254: v1(31.63,8.02) 29.75,8.02 29.14,8.63 29.14,9.39 v1(29.19,9.44)
$1N6077: length 3.7
  Top Layer w0.254: USBC1.A5 48.11,11.5 48.08,11.37
$1N6100: length 3.6
  Top Layer w0.254: 51.11,11.34 51.14,11.37 ; R4.2 50.88,11.42 50.88,10.36 51.11,10.13 USBC1.B5
$1N6280: length 3.2
  Top Layer w0.254: PW-LED.1 83.96,13.72 84.51,14.27 84.51,15.99 R7.2
$1N6289: length 2.5
  Top Layer w0.254: LED1.1 41.99,3.3 41.99,5.73
$1N17912: length 2.5
  Top Layer w0.254: 56.28,5.73 56.3,5.71 LED2.1
$1N31687: length 5.9
  Bottom Layer w1.016: CN1.1 39.79,43.61 R16.2 ; R15.2 39.2,44.1
$1N33760: length 1.9
  Top Layer w0.254: 31.01,21.18 31.01,20.51 30.54,20.04 30.54,19.44

## Copper pours and planes (outline as drawn; the poured copper is in the pictures)
3.3V on Top Layer: 55.89,32.78 56.25,32.42 56.25,30.99 55.84,30.59 44.26,30.59 44.11,30.74 44.11,32.47 44.41,32.78
3.3V on Top Layer: 63.33,22.3 60.89,19.86 60.89,15.74 61.14,15.49 62.82,15.49 62.97,15.64 62.97,18.39 63.43,18.84 66.99,18.84 66.99,21.94 66.63,22.3
5V on Top Layer: 53.02,22.09 56.06,22.09 58.4,19.76 58.4,14.95 60.23,13.12 60.23,11.63 62.62,9.24 68.76,9.24 70.08,7.92 70.08,6.2 69.93,6.04 69.68,5.79 60.33,5.79 60.08,6.04 60.08,9.6 56.32,13.36 56.32,18.49 53.68,18.49 52.86,19.3 52.86,21.94
12V on Top Layer: 40.57,26.16 48.24,26.16 49,25.4 49,21.89 48.55,21.43 42.86,21.43 40.57,23.72
GND on Top Layer: -13.38,90.57 116.26,90.57 116.26,-10.62 -13.38,-10.62
GND on Bottom Layer: -7.89,83.41 107.22,83.41 107.22,-11.18 -7.89,-11.18
VBUS on Bottom Layer: 45.43,19.6 49.71,19.6 52.76,16.56 52.76,9.2 52.29,8.72 46.57,8.72 46.01,9.29 46.01,12.54 45.09,13.46 45.09,19.27

## Text on the board
Bottom Silkscreen Layer: IO13 | GND | 5V | VCC | SCL | IO18 | SDA | IO23 | SDO | RST | IO26 | DC | IO25 | CS | IO19 | IO5 | CS2 | BL | 3.3V | 12V | Power_IN | NC | 485-A | 485-B | USBD- | USBD+ | CH340--通信模块 | CH340--ESP32-U1 | ESP32-U2--通信模块 | 外接输入电压选择 | ②
Top Silkscreen Layer: IO18(SCL) | IO19(CS) | IO23(SDA) | COMM-R | COMM-T | IO13(MISO) | IO5(CS2) | IO15-LED | IO34(IN) | IO22-SCL | IO21-SDA | IO35(IN) | 12V | GND | 3.3V | NC | 5V | IO4 | IO27 | IO33 | IO12 | IO14 | IO32 | IO18 | IO23 | IO13 | IO26 | IO25 | IO19 | IO5 | KEY1(IO36) | ESP32-RST | USB-SW | ESP32-BOOT | Power-SW | KEY2(IO39) | Power-LED | LED1(IO2) | LED2(IO15) | ESP32功能模块
